# Altium project NH Speaker Sensor 16CH 2.3_C.PrjPcb (part 1 of 2)
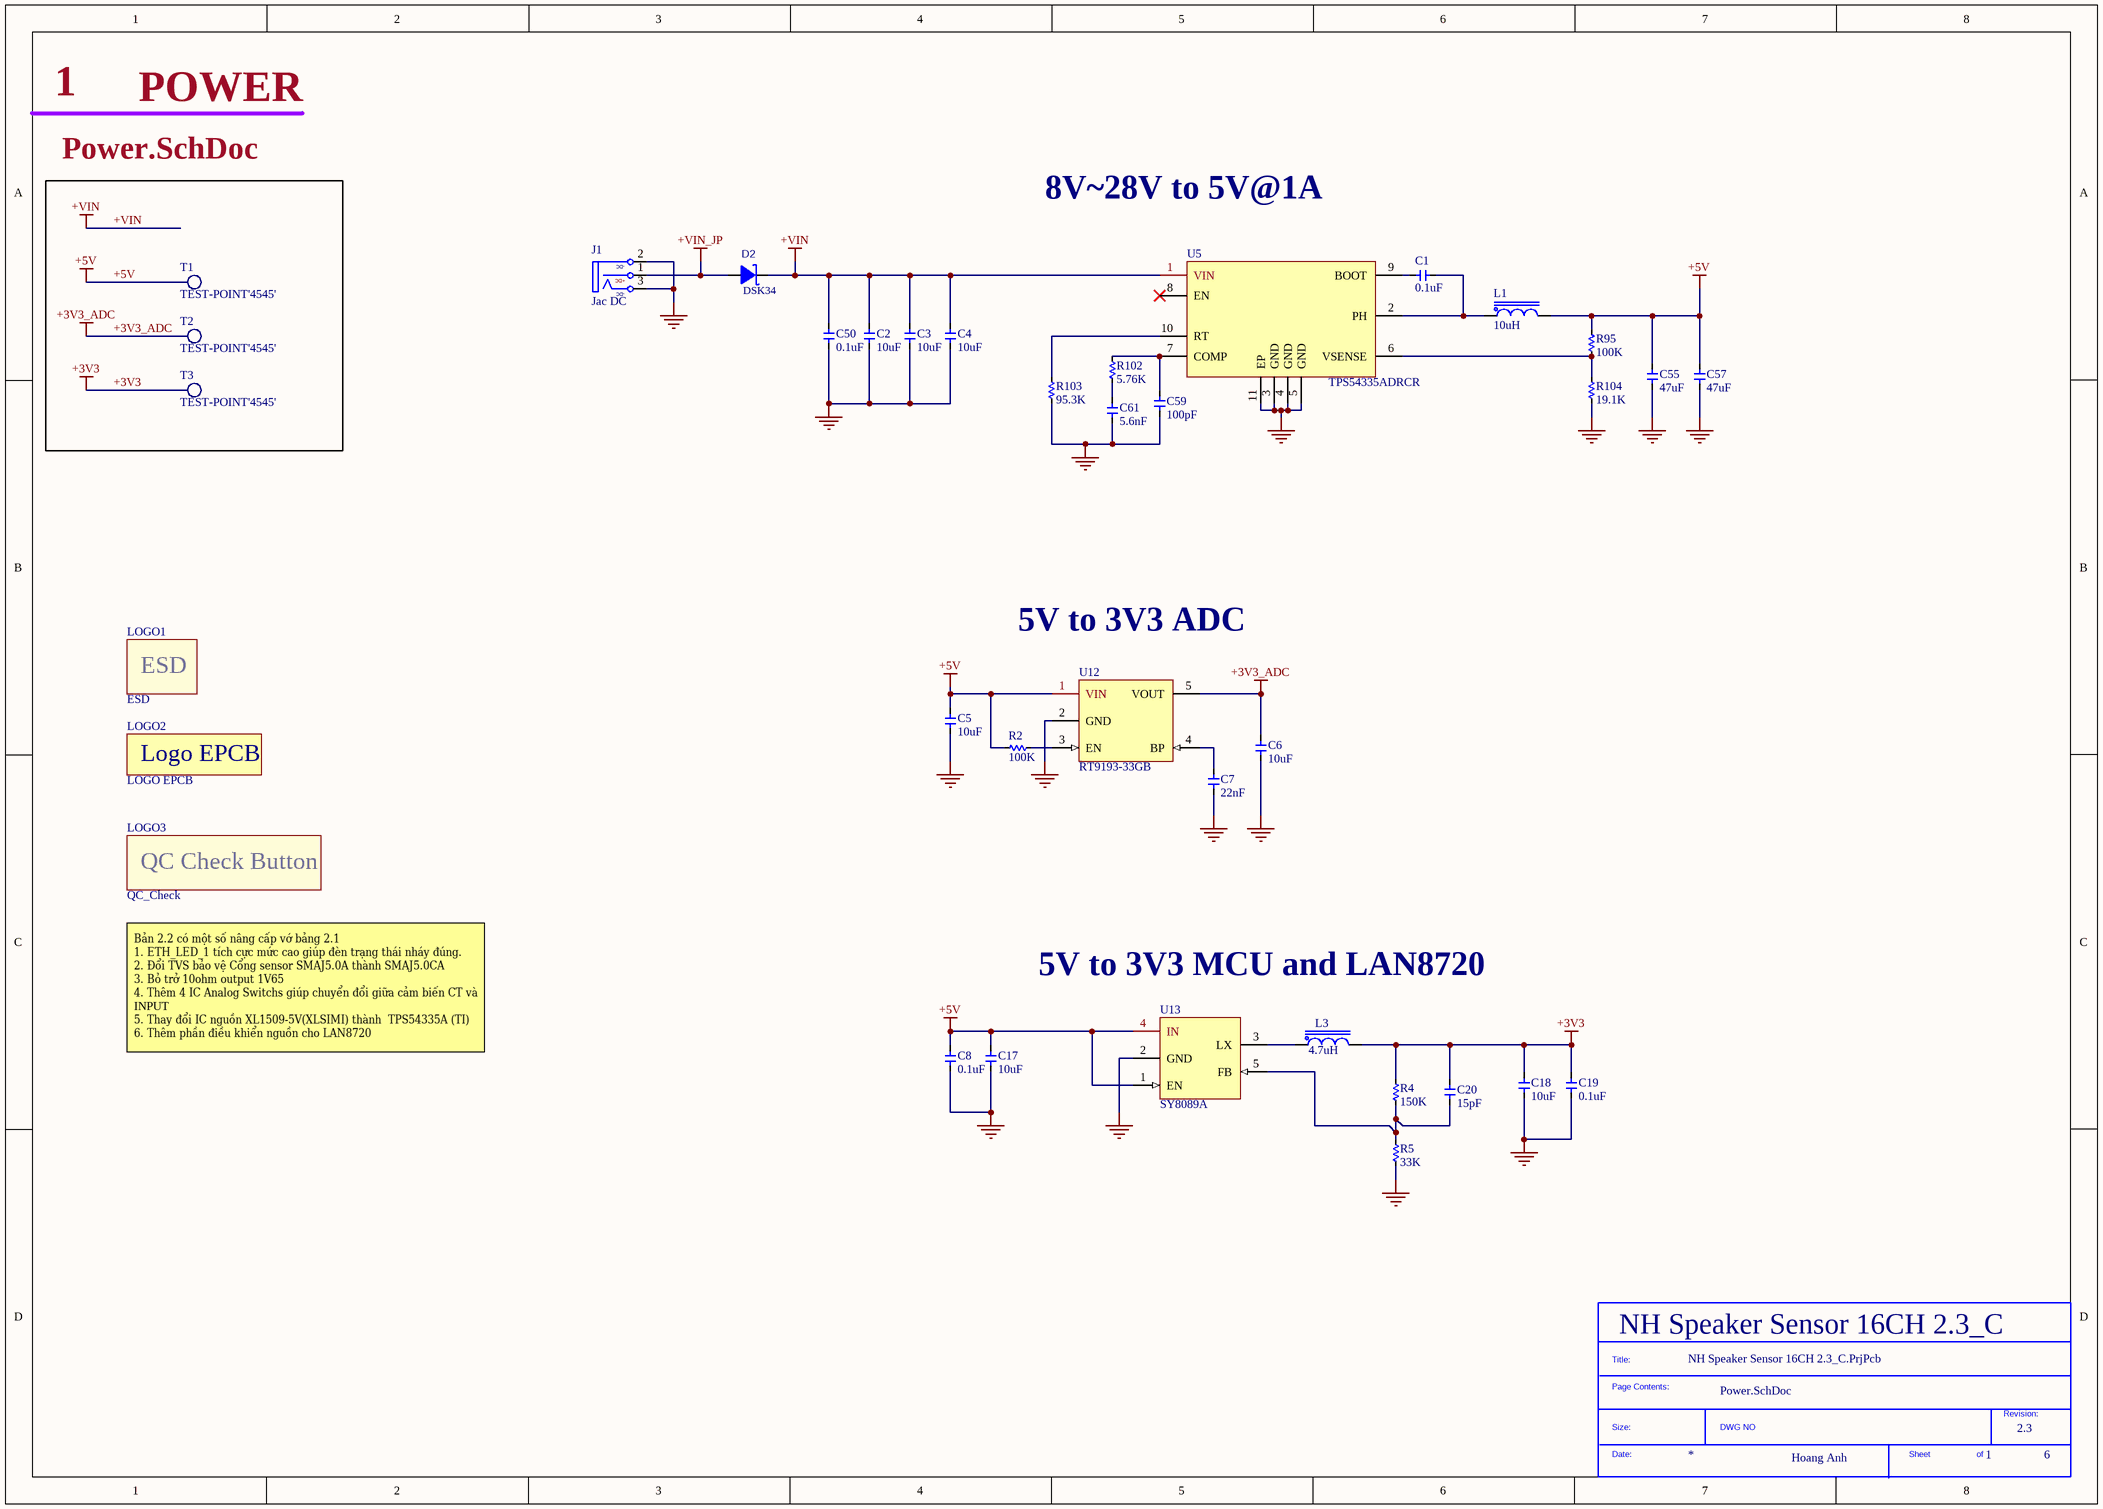
[diagram p0: Power.SchDoc]
DrawnBy_1: Hoang Anh; Revision_1: 1.1; Title_1: NH Speaker Sensor 16CH LAN8720
6 sheets, 309 parts. Net scope: global (net labels, ports and power ports of the same name join across sheets).
Board file: NH Speaker Sensor 16CH 2.3_C.PcbDoc
Sheets:
  Power.SchDoc
  Ethernet.SchDoc
  RS485.SchDoc
  Sensor.SchDoc
  Console.SchDoc
  MCU.SchDoc

## Sheet Power.SchDoc: NH Speaker Sensor 16CH 2.3_C
size A3; Revision: 2.3; SheetNumber: 1; SheetTotal: 6

### Parts
(Parts that share a designator on the sheet are numbered #1, #2 ... from top to bottom, then left to right.)
*?#1  SDTitleBlock  (value not drawn)  (graphical)
C1  0.1uF  [C_0603]
C2  10uF  [C_0805]
C3  10uF  [C_0805]
C4  10uF  [C_0805]
C5  10uF  [C_0603]
C6  10uF  [C_0603]
C7  22nF  [C_0603]
C8  0.1uF  [C_0603]
C17  10uF  [C_0805]
C18  10uF  [C_0805]
C19  0.1uF  [C_0603]
C20  15pF  [C_0603]
C50  0.1uF  [C_0603]
C55  47uF  [C_0805]
C57  47uF  [C_0805]
C59  100pF  [C_0603]
C61  5.6nF  [C_0603]
D2  DSK34  [SOD-123_L2.8-W1.8-LS3.7-RD]
J1  Jac DC  [DC0]
L1  10uH  [IND-SMD_L4.4-W4.2]
L3  4.7uH  [IND-SMD_L4.4-W4.2]
LOGO1  ESD  [LOGO ESD]  (no BOM)
LOGO2  LOGO EPCB  [LOGO EPCB TopLayer]  (no BOM)
LOGO3  QC_Check  [QC_CHECK]  (no BOM)
R2  100K  [R_0603]
R4  150K  [R_0603]
R5  33K  [R_0603]
R95  100K  [R_0603]
R102  5.76K  [R_0603]
R103  95.3K  [R_0603]
R104  19.1K  [R_0603]
T1  TEST-POINT'4545'  [TP-D45MIL]  (no BOM)
T2  TEST-POINT'4545'  [TP-D45MIL]  (no BOM)
T3  TEST-POINT'4545'  [TP-D45MIL]  (no BOM)
U5  TPS54335ADRCR  [VSON-10_L3.0-W3.0-P0.50-TL-EP]
U12  RT9193-33GB  [SOT-23-5_L3.0-W1.7-P0.95-LS2.8-BR]
U13  SY8089A  [SOT-23-5_L3.0-W1.7-P0.95-LS2.8-BR]

### Nets
+3V3: C18.2 C19.2 C20.2 L3.2 R4.1 T3.T
+3V3_ADC: C6.2 T2.T U12.5(VOUT)
+5V: C5.2 C8.2 C17.2 C55.2 C57.2 L1.2 R2.2 R95.1 T1.T U12.1(VIN) U13.1(EN) U13.4(IN)
+VIN: C2.2 C3.2 C4.2 C50.2 D2.1(A) U5.1(VIN)
+VIN_JP: D2.2(K) J1.1(S)
GND: C2.1 C3.1 C4.1 C5.1 C6.1 C7.1 C8.1 C17.1 C18.1 C19.1 C50.1 C55.1 C57.1 C59.1 C61.1 J1.2(T) J1.3(TN) R5.2 R103.2 R104.2 U5.3(GND) U5.4(GND) U5.5(GND) U5.11(EP) U12.2(GND) U13.2(GND)
NetC1_1: C1.1 L1.1 U5.2(PH)
NetC1_2: C1.2 U5.9(BOOT)
NetC7_2: C7.2 U12.4(BP)
NetC20_1: C20.1 R4.2 R5.1 U13.5(FB)
NetC59_2: C59.2 R102.1 U5.7(COMP)
NetC61_2: C61.2 R102.2
NetL3_1: L3.1 U13.3(LX)
NetR2_1: R2.1 U12.3(EN)
NetR95_2: R95.2 R104.1 U5.6(VSENSE)
NetR103_1: R103.1 U5.10(RT)

Not connected (* = marked no-connect by the designer): U5 8(EN)*

### Notes on the sheet
- POWER
- 8V~28V to 5V@1A
- 5V to 3V3 ADC
- 5V to 3V3 MCU and LAN8720
- (near LOGO3) Bản 2.2 có một số nâng cấp vớ bảng 2.1
  1. ETH_LED_1 tích cực mức cao giúp đèn trạng thái nháy đúng.
  2. Đổi TVS bảo vệ Cổng sensor SMAJ5.0A thành SMAJ5.0CA
  3. Bỏ trở 10ohm output 1V65
  4. Thêm 4 IC Analog Switchs giúp chuyển đổi giữa cảm biến CT và INPUT
  5. Thay đổi IC nguồn XL1509-5V(XLSIMI) thành  TPS54335A (TI)
  6. Thêm phần điều khiển nguồn cho LAN8720
- (in symbol DC+02I) -DC; +DC
- (in symbol LOGO EPCB TopLayer) Logo EPCB
- (in symbol QC_Check) QC Check Button
- (in symbol SDTitleBlock) Title:; Page Contents:; Revision:; Size:; DWG NO; Date:; Sheet; of

### Library data of the parts
*?#1 = SDTitleBlock: TitleBlock
C1 C8 C19 C50 = CC0603KRX7R9BB104: 100NF 50V 0603 ROHS; Manufacturer: YAGEO; Manufacturer Part Number: CC0603KRX7R9BB104; Package: 0603; LCSC Part Number: C14663; Assembly type: SMT Assembly; ComponentLink1Description: Digikey Link; ComponentLink1URL: https://www.digikey.com/en/products/detail/yageo/CC0603KRX7R9BB104/2103082?s=N4IgTCBcDaIMwEYEFoFwCzuWZA5AIiALoC%2BQA; ComponentLink2Description: LCSC Link; ComponentLink2URL: https://jlcpcb.com/parts/componentSearch?searchTxt=10k%200603
C2-C4 C17 C18 = GRM21BR61H106KE43L: 10uF ±10% 50V X5R 0805; Manufacturer: Murata Electronics; ComponentLink1URL: https://lcsc.com/product-detail/Multilayer-Ceramic-Capacitors-MLCC-SMD-SMT_SAMSUNG_CL21A106KAYNNNE_10uF-106-10-25V_C15850.html/?href=jlc-SMT; ComponentLink1Description: LCSC Link; Manufacturer Part Number: GRM21BR61H106KE43L; LCSC Part Number: C440198; Package: 0805; Assembly Type: SMT Assembly
C5 C6 = CL10A106KP8NNNC: 10uF 10V 0603 Multilayer Ceramic Capacitors MLCC - SMD/SMT ROHS; Manufacturer: Samsung Electro-Mechanics; Manufacturer Part Number: CL10A106KP8NNNC; Package: 0603; LCSC Part Number: C19702; ComponentLink1Description: Digikey Link; ComponentLink1URL: https://www.digikey.com/en/products/detail/samsung-electro-mechanics/CL10A105KB8NNNC/3887518?s=N4IgTCBcDaIMIBkCMAGAgqgrAaQEIA4A5YuEAXQF8g; ComponentLink2Description: LCSC Link; ComponentLink2URL: https://jlcpcb.com/parts/componentSearch?searchTxt=10k%200603; Assembly Type: SMT Assembly
C7 = CL10B223KB8NNNC: 22nF 50V 0603 Multilayer Ceramic Capacitors MLCC - SMD/SMT ROHS; Manufacturer: Samsung Electro-Mechanics; Manufacturer Part Number: CL10B223KB8NNNC; Package: 0603; LCSC Part Number: C21122; ComponentLink1Description: Digikey Link; ComponentLink2Description: LCSC Link; ComponentLink2URL: https://jlcpcb.com/parts/componentSearch?searchTxt=10k%200603; Assembly Type: SMT Assembly
C20 = CL10C150JB8NNNC: 15pF ±5% 50V C0G 0603 Multilayer Ceramic Capacitors MLCC - SMD/SMT RoHS; Manufacturer: Samsung Electro-Mechanics; Manufacturer Part Number: CL10C150JB8NNNC; Package: 0603; LCSC Part Number: C1644; ComponentLink1Description: Digikey Link; Assembly Type: SMT Assembly
C55 C57 = GRM21BR61A476ME15L: 47uF ±20% 10V X5R 0805 Multilayer Ceramic Capacitors MLCC - SMD/SMT RoHS; Manufacturer: Murata Electronics; ComponentLink1URL: https://lcsc.com/product-detail/Multilayer-Ceramic-Capacitors-MLCC-SMD-SMT_SAMSUNG_CL21A106KAYNNNE_10uF-106-10-25V_C15850.html/?href=jlc-SMT; ComponentLink1Description: LCSC Link; Manufacturer Part Number: GRM21BR61A476ME15L; LCSC Part Number: C124129; Package: 0805; Assembly Type: SMT Assembly
C59 = 0603CG101J500NT: 100pF 50V C0G ±5% 0603 Multilayer Ceramic Capacitors MLCC - SMD/SMT ROHS; Manufacturer: FH(Guangdong Fenghua Advanced Tech); Manufacturer Part Number: 0603CG101J500NT; Package: 0603; LCSC Part Number: C1635; Assembly Type: SMT Assembly; ComponentLink1Description: Digikey Link; ComponentLink2Description: LCSC Link
C61 = 0603B562K500NT: 5.6nF 50V X7R ±10% 0603 Multilayer Ceramic Capacitors MLCC - SMD/SMT ROHS; Manufacturer: FH(Guangdong Fenghua Advanced Tech); Manufacturer Part Number: 0603B562K500NT; Package: 0603; LCSC Part Number: C1628; Assembly Type: SMT Assembly; ComponentLink1Description: Digikey Link
D2 = DSK34: DSK34 40V 550mV@3A 3A SOD-123 Schottky Barrier Diodes (SBD) ROHS Copy; Manufacturer: MDD（Microdiode Electronics); Manufacturer Part Number: DSK34; Package: SOD-123; LCSC Part Number: C41029; Assembly Type: SMT Assembly
J1 = DC+02I: Jac DC input 5.5x2.1MM; Manufacturer: JINJIA; Manufacturer Part Number: DC+02I; LCSC Part Number: C718033; Package: Through Hole; Assembly Type: Hand Soldering
L1 = IND_MWSA0402S-100MT: POWER INDUCTORS SMD,4.2X4.4X2.0MM ROHS; Manufacturer: Sunlord; ComponentLink1URL: http://www.mouser.com/ds/2/390/CDRH5D28RHP-523509.pdf?src-supplier=Mouser; ComponentLink1Description: http://www.mouser.com/ds/2/390/CDRH5D28RHP-523509.pdf?src-supplier=Mouser; ComponentLink2URL: http://products.sumida.com/products/pdf/CDRH5D28RHP.pdf?src-supplier=Digi-Key; ComponentLink2Description: http://products.sumida.com/products/pdf/CDRH5D28RHP.pdf?src-supplier=Digi-Key; ComponentLink3URL: http://www.sumida.com/products/pdf/CDRH5D28,5D28R,5D28RHP.pdf?src-supplier=Avnet; ComponentLink3Description: http://www.sumida.com/products/pdf/CDRH5D28,5D28R,5D28RHP.pdf?src-supplier=Avnet; ComponentLink4URL: http://datasheet.octopart.com/CDRH5D28RHPNP-4R7NC-Sumida-datasheet-8324507.pdf?src-supplier=_legacy+Avnet; ComponentLink4Description: http://datasheet.octopart.com/CDRH5D28RHPNP-4R7NC-Sumida-datasheet-8324507.pdf?src-supplier=_legacy+Avnet; Manufacturer Part Number: MWSA0402S-100MT; LCSC Part Number: C408339; Package: SMD-4.2x4.4x2.0; Assembly Type: SMT Assembly
L3 = IND_MWSA0402S-4R7MT: 4.7uH IND 4.2x4.4x2.0mm 2.8A 4.7uH ±20% 105mΩ SMD Power Inductors ROHS; Manufacturer: Sunlord; Manufacturer Part Number: MWSA0402S-4R7MT; LCSC Part Number: C408337; Package: SMD-4.2x4.4x2.0; Assembly Type: SMT Assembly
LOGO1 = ESD: lOGO ESD
LOGO2 = LOGO EPCB TopLayer
R2 R95 = 0603WAF1003T5E: 100KOHMS ±1% 1/10W 0603 ROHS; Manufacturer: Uniroyal Elec; Manufacturer Part Number: 0603WAF1003T5E; LCSC Part Number: C25803; Package: 0603; Assembly Type: SMT Assembly
R4 = 0603WAF1503T5E: 150kΩ ±1% ±100ppm/℃ 0.1W 0603 Chip Resistor - Surface Mount ROHS; Manufacturer: Uniroyal Elec; Manufacturer Part Number: 0603WAF1503T5E; LCSC Part Number: C22807; Package: 0603; Assembly Type: SMT Assembly
R5 = 0603WAF3302T5E: 33KOHMS ±1% 1/10W 0603 ROHS; Manufacturer: Uniroyal Elec; ComponentLink1URL: https://datasheet.ciiva.com/8883/pyu-rc0603-51-rohs-l-4-8883051.pdf?src-supplier=Avnet; ComponentLink1Description: https://datasheet.ciiva.com/8883/pyu-rc0603-51-rohs-l-4-8883051.pdf?src-supplier=Avnet; ComponentLink2URL: https://datasheet.ciiva.com/7746/443971-7746461.pdf?src-supplier=Element14; ComponentLink2Description: https://datasheet.ciiva.com/7746/443971-7746461.pdf?src-supplier=Element14; ComponentLink3URL: https://datasheet.ciiva.com/22747/443971-22747533.pdf?src-supplier=Element14; ComponentLink3Description: https://datasheet.ciiva.com/22747/443971-22747533.pdf?src-supplier=Element14; ComponentLink4URL: https://datasheet.ciiva.com/7746/443971-7746462.pdf?src-supplier=Element14; ComponentLink4Description: https://datasheet.ciiva.com/7746/443971-7746462.pdf?src-supplier=Element14; Manufacturer Part Number: 0603WAF3302T5E; LCSC Part Number: C4216; Package: 0603; Assembly Type: SMT Assembly
R102 = 0603WAF5761T5E: 5.76kΩ 0603 1/10W Thick Film Resistors 75V ±1% ±100ppm/℃ -55℃~+155℃ Chip Resistor - Surface Mount ROHS; Manufacturer: Uniroyal Elec; Manufacturer Part Number: 0603WAF5761T5E; LCSC Part Number: C23070; Package: 0603; Assembly Type: SMT Assembly
R103 = 0603WAF9532T5E: 95.3kΩ 0603 1/10W Thick Film Resistors 75V ±1% ±100ppm/℃ -55℃~+155℃ Chip Resistor - Surface Mount ROHS; Manufacturer: Uniroyal Elec; Manufacturer Part Number: 0603WAF9532T5E; LCSC Part Number: C23267; Package: 0603; Assembly Type: SMT Assembly
R104 = 0603WAF1912T5E: 19.1kΩ 0603 1/10W Thick Film Resistors 75V ±1% ±100ppm/℃ -55℃~+155℃ Chip Resistor - Surface Mount ROHS; Manufacturer: Uniroyal Elec; Manufacturer Part Number: 0603WAF1912T5E; LCSC Part Number: C22897; Package: 0603; Assembly Type: SMT Assembly
T1-T3 = TEST-POINT'4545': Manufacturer: No; Manufacturer Part Number: No; LCSC Part Number: No; Package: No
U5 = TPS54335ADRCR: TPS54335A 28V 3A SOP-8_EP_150mil DC-DC Converters RoHS; Manufacturer: Texas Instruments; Manufacturer Part Number: TPS54335ADRCR; ComponentLink1URL: http://www.jameco.com/Jameco/Products/ProdDS/1523997.pdf?src-supplier=Jameco; ComponentLink1Description: http://www.jameco.com/Jameco/Products/ProdDS/1523997.pdf?src-supplier=Jameco; ComponentLink2URL: http://www.ti.com/general/docs/lit/getliterature.tsp?genericPartNumber=TPS5431&&fileType=pdf&src-supplier=Avnet; ComponentLink2Description: http://www.ti.com/general/docs/lit/getliterature.tsp?genericPartNumber=TPS5431&&fileType=pdf&src-supplier=Avnet; ComponentLink3URL: http://focus.ti.com/lit/ds/symlink/tps5430.pdf?src-supplier=Avnet+Europe; ComponentLink3Description: http://focus.ti.com/lit/ds/symlink/tps5430.pdf?src-supplier=Avnet+Europe; ComponentLink4URL: http://www.ti.com/lit/ds/symlink/tps5431.pdf?src-supplier=Digi-Key; ComponentLink4Description: http://www.ti.com/lit/ds/symlink/tps5431.pdf?src-supplier=Digi-Key; ComponentLink5URL: https://www.verical.com/server-webapp/html/getDatasheet?partID=214658&src-supplier=Verical; ComponentLink5Description: https://www.verical.com/server-webapp/html/getDatasheet?partID=214658&src-supplier=Verical; ComponentLink6URL: http://www.produktinfo.conrad.com/datenblaetter/1000000-1099999/001014839-da-01-en-IC_REG_BUCK_ADJ_3_TPS5430DDAR_SOIC_8_TID.pdf?src-supplier=Conrad; ComponentLink6Description: http://www.produktinfo.conrad.com/datenblaetter/1000000-1099999/001014839-da-01-en-IC_REG_BUCK_ADJ_3_TPS5430DDAR_SOIC_8_TID.pdf?src-supplier=Conrad; Package: VSON-10; LCSC Part Number: C473400; Assembly Type: SMT Assembly
U12 = RT9193-33GB: 5.5V 300mV @ 300mA - - Fixed 3.3V SOT-23-5 Linear Voltage Regulators (LDO) ROHS; Manufacturer: Richtek Tech; Manufacturer Part Number: RT9193-33GB; Package: SOT-23-5; LCSC Part Number: C15651; Assembly Type: SMT Assembly
U13 = SY8089A1AAC: High Efficiency 5.5V, 2A continuous, 3A peak, 1MHz  Synchronous Step Down Regulator; Manufacturer: Silergy Corp; Manufacturer Part Number: SY8089A1AAC; LCSC Part Number: C479074; Package: SOT-23-5; Assembly Type: SMT Assembly

## Sheet Ethernet.SchDoc: NH Speaker Sensor 16CH 2.3_C
size A3; Revision: 2.3; SheetNumber: 2; SheetTotal: 6
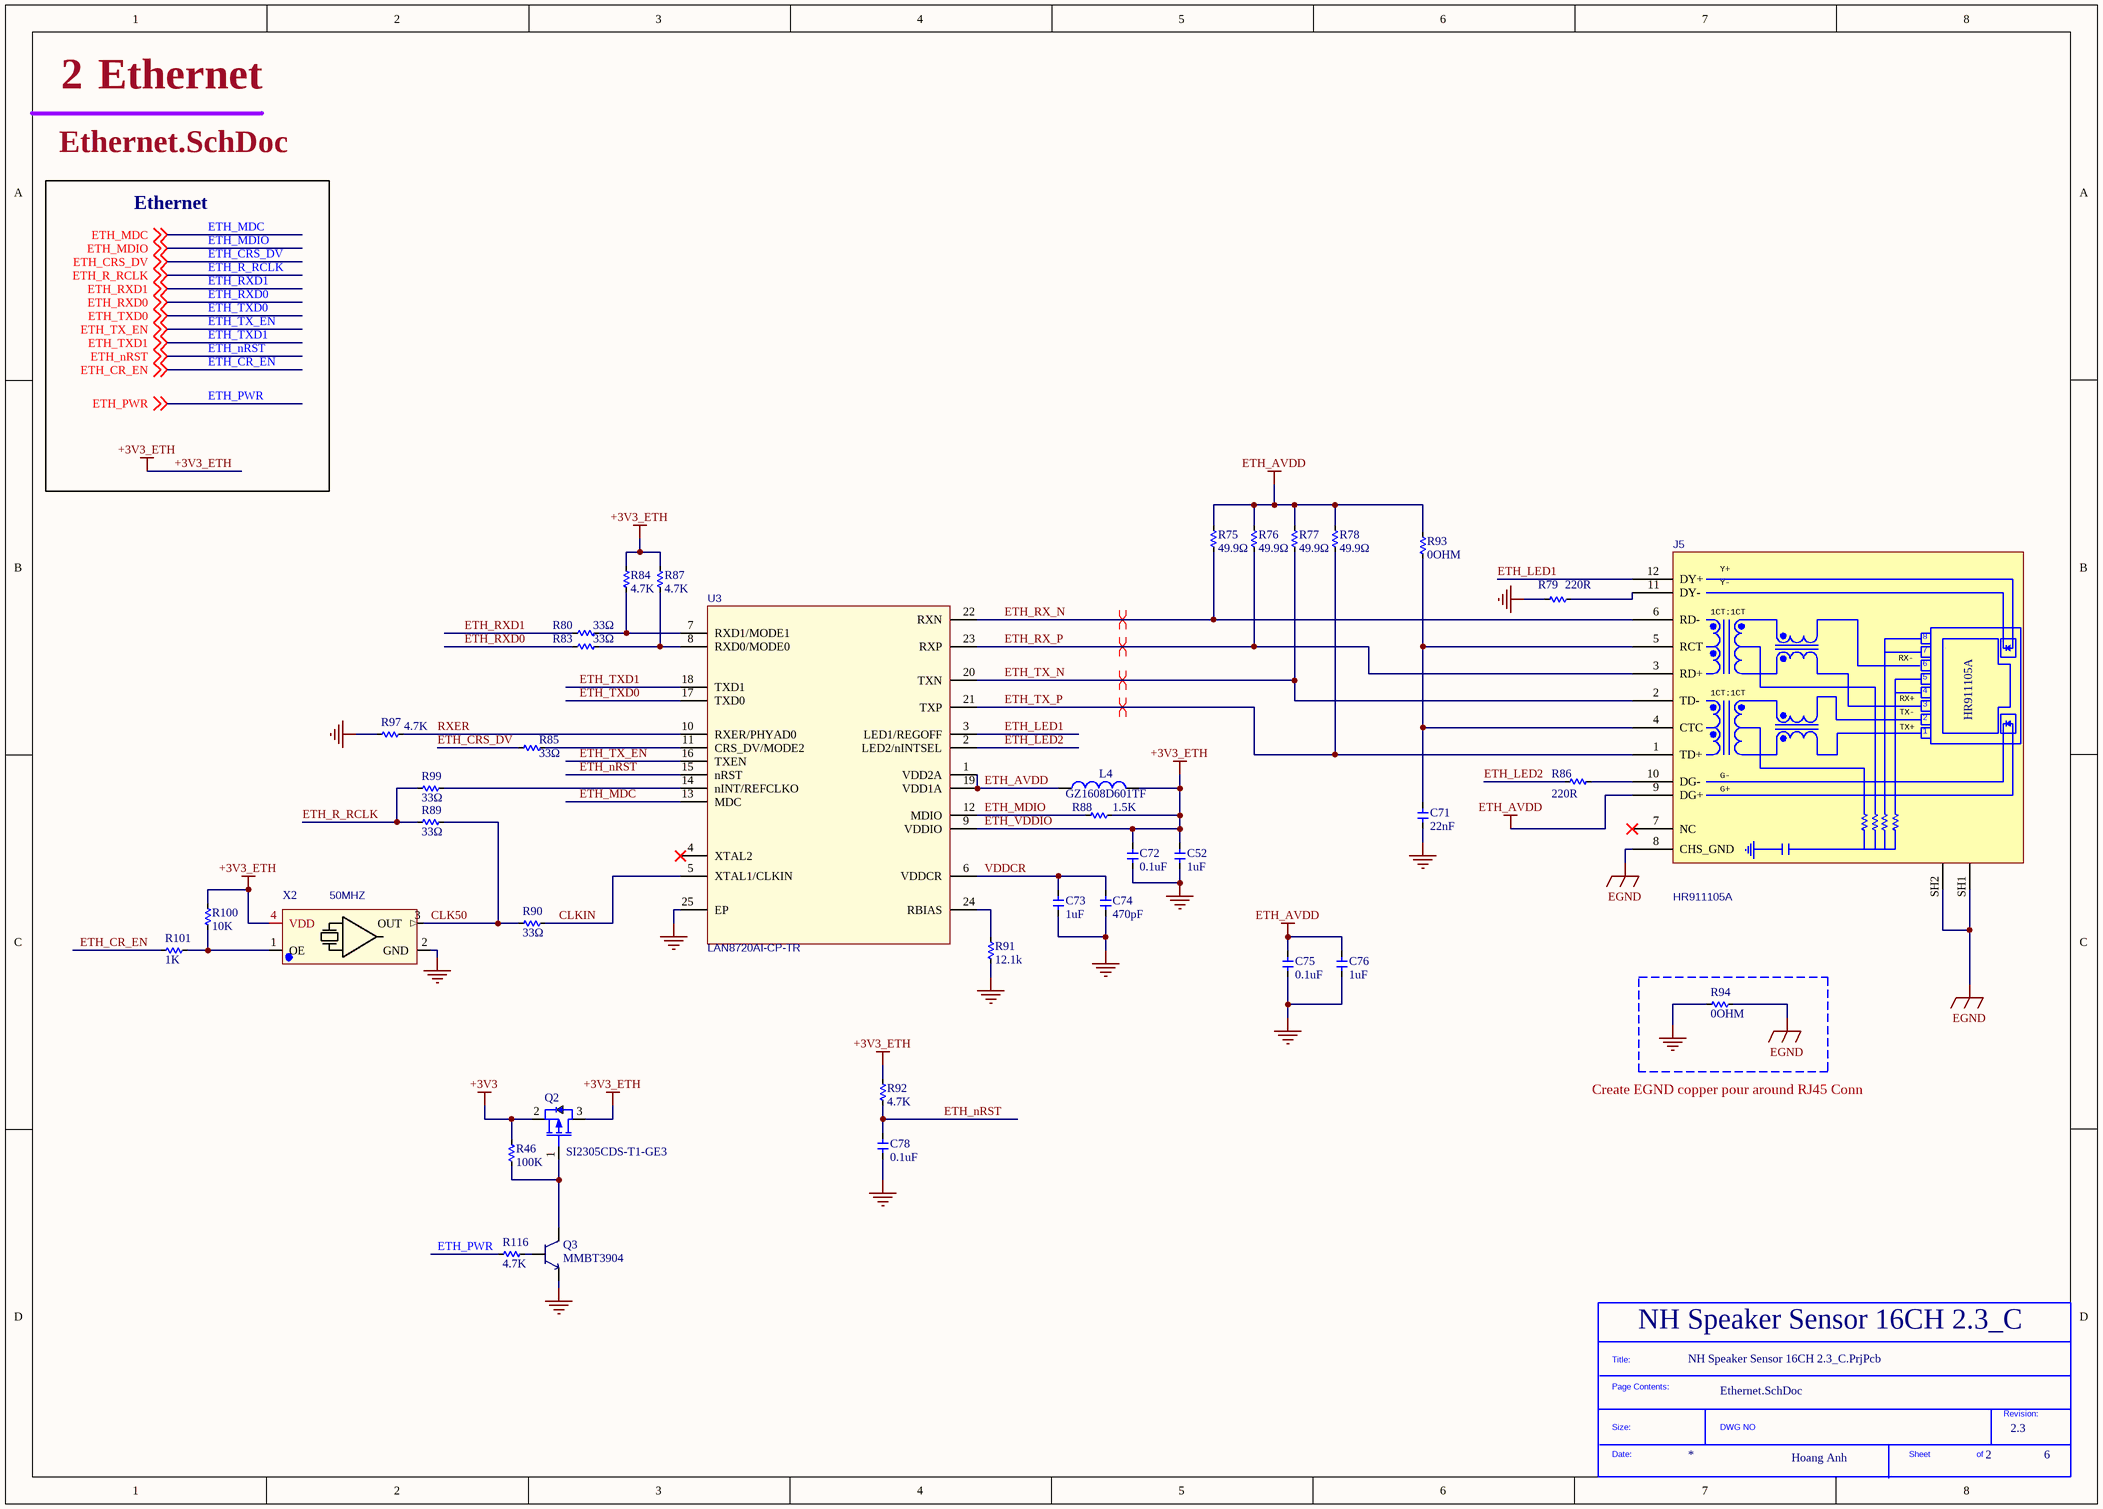
[diagram p1: Ethernet.SchDoc]

### Parts
(Parts that share a designator on the sheet are numbered #1, #2 ... from top to bottom, then left to right.)
*?#2  SDTitleBlock  (value not drawn)  (graphical)
C52  1uF  [C_0603]
C71  22nF  [C_0603]
C72  0.1uF  [C_0603]
C73  1uF  [C_0603]
C74  470pF  [C_0603]
C75  0.1uF  [C_0603]
C76  1uF  [C_0603]
C78  0.1uF  [C_0603]
J5  HR911105A  [RJ45-TH_HR911105A]
L4  GZ1608D601TF  [L_0603]
Q2  SI2305CDS-T1-GE3  [SOT-23-3_L2.9-W1.6-P1.90-LS2.8-BR]
Q3  MMBT3904  [SOT-23-3_L2.9-W1.3-P1.90-LS2.4-BR]
R46  100K  [R_0603]
R75  49.9Ω  [R_0603]
R76  49.9Ω  [R_0603]
R77  49.9Ω  [R_0603]
R78  49.9Ω  [R_0603]
R79  220R  [R_0603]
R80  33Ω  [R_0603]
R83  33Ω  [R_0603]
R84  4.7K  [R_0603]
R85  33Ω  [R_0603]
R86  220R  [R_0603]
R87  4.7K  [R_0603]
R88  1.5K  [R_0603]
R89  33Ω  [R_0603]
R90  33Ω  [R_0603]
R91  12.1k  [R_0603]
R92  4.7K  [R_0603]
R93  0OHM  [R_0603]
R94  0OHM  [R_0603]
R97  4.7K  [R_0603]
R99  33Ω  [R_0603]
R100  10K  [R_0603]
R101  1K  [R_0603]
R116  4.7K  [R_0603]
U3  LAN8720AI-CP-TR  [QFN-24_L4.0-W4.0-P0.50-BL-EP2.6]
X2  50MHZ  [SMD-3225_4P]

### Nets
+3V3: Q2.2(S) R46.1
+3V3_ETH: C52.2 C72.2 L4.2 Q2.3(D) R84.1 R87.1 R88.1 R92.1 R100.1 U3.9(VDDIO) X2.4(VDD)  [also labelled ETH_VDDIO]
EGND: J5.8(CHS_GND) J5.SH1 J5.SH2 R94.1
ETH_AVDD: C75.2 C76.2 J5.9(DG+) L4.1 R75.1 R76.1 R77.1 R78.1 R93.1 U3.1(VDD2A) U3.19(VDD1A)
GND: C52.1 C71.1 C72.1 C73.1 C74.1 C75.1 C76.1 C78.1 Q3.2 R79.2 R91.2 R94.2 R97.2 U3.25(EP) X2.2(GND)
CLK50: R89.1 R90.2 X2.3(OUT)
CLKIN: R90.1 U3.5(XTAL1/CLKIN)
ETH_CR_EN: R101.2 ; off-sheet ETH_CR_EN
ETH_CRS_DV: R85.2 ; off-sheet ETH_CRS_DV
ETH_LED1: J5.12(DY+) U3.3(LED1/REGOFF)
ETH_LED2: R86.2 U3.2(LED2/nINTSEL)
ETH_MDC: U3.13(MDC) ; off-sheet ETH_MDC
ETH_MDIO: R88.2 U3.12(MDIO) ; off-sheet ETH_MDIO
ETH_nRST: C78.2 R92.2 U3.15(nRST) ; off-sheet ETH_nRST
ETH_PWR: R116.2 ; off-sheet ETH_PWR
ETH_R_RCLK: R89.2 R99.2 ; off-sheet ETH_R_RCLK
ETH_RX_N: J5.6(RD-) R75.2 U3.22(RXN)
ETH_RX_P: J5.3(RD+) R76.2 U3.23(RXP)
ETH_RXD0: R83.2 ; off-sheet ETH_RXD0
ETH_RXD1: R80.2 ; off-sheet ETH_RXD1
ETH_TX_EN: U3.16(TXEN) ; off-sheet ETH_TX_EN
ETH_TX_N: J5.2(TD-) R77.2 U3.20(TXN)
ETH_TX_P: J5.1(TD+) R78.2 U3.21(TXP)
ETH_TXD0: U3.17(TXD0) ; off-sheet ETH_TXD0
ETH_TXD1: U3.18(TXD1) ; off-sheet ETH_TXD1
RXER: R97.1 U3.10(RXER/PHYAD0)
VDDCR: C73.2 C74.2 U3.6(VDDCR)
NetC71_2: C71.2 J5.4(CTC) J5.5(RCT) R93.2
NetJ5_10: J5.10(DG-) R86.1
NetJ5_11: J5.11(DY-) R79.1
NetQ2_1: Q2.1(G) Q3.3 R46.2
NetQ3_1: Q3.1 R116.1
NetR80_1: R80.1 R84.2 U3.7(RXD1/MODE1)
NetR83_1: R83.1 R87.2 U3.8(RXD0/MODE0)
NetR85_1: R85.1 U3.11(CRS_DV/MODE2)
NetR91_1: R91.1 U3.24(RBIAS)
NetR99_1: R99.1 U3.14(nINT/REFCLKO)
NetR100_2: R100.2 R101.1 X2.1(OE)

Not connected (* = marked no-connect by the designer): J5 7(NC)*; U3 4(XTAL2)*

### Layout directives
differential pair: ETH_RX_N, ETH_RX_P, ETH_TX_N, ETH_TX_P

### Notes on the sheet
- Ethernet
- Create EGND copper pour around RJ45 Conn
- (in symbol RJ45_HR911105A) Y+; Y-; 1CT:1CT; RX-; RX+; TX-; TX+; G-; G+
- (in symbol SDTitleBlock) Title:; Page Contents:; Revision:; Size:; DWG NO; Date:; Sheet; of

### Library data of the parts
*?#2 = SDTitleBlock: TitleBlock
C52 C73 C76 = CL10A105KB8NNNC: 1UF 50V 0603 ROHS; Manufacturer: Samsung Electro-Mechanics; Manufacturer Part Number: CL10A105KB8NNNC; Package: 0603; LCSC Part Number: C15849; ComponentLink1Description: Digikey Link; ComponentLink1URL: https://www.digikey.com/en/products/detail/samsung-electro-mechanics/CL10A105KB8NNNC/3887518?s=N4IgTCBcDaIMIBkCMAGAgqgrAaQEIA4A5YuEAXQF8g; ComponentLink2Description: LCSC Link; ComponentLink2URL: https://jlcpcb.com/parts/componentSearch?searchTxt=10k%200603; Assembly Type: SMT Assembly
C71 = CL10B223KB8NNNC: as C7 on sheet Power; Manufacturer Part Number: CL10B223KB8NNNC; Package: 0603; LCSC Part Number: C21122; ComponentLink1Description: Digikey Link; ComponentLink2Description: LCSC Link; ComponentLink2URL: https://jlcpcb.com/parts/componentSearch?searchTxt=10k%200603; Assembly Type: SMT Assembly
C72 C75 C78 = CC0603KRX7R9BB104: 100NF 50V 0603 ROHS; Manufacturer: YAGEO; Manufacturer Part Number: CC0603KRX7R9BB104; Package: 0603; LCSC Part Number: C14663; ComponentLink1Description: Digikey Link; ComponentLink1URL: https://www.digikey.com/en/products/detail/yageo/CC0603KRX7R9BB104/2103082?s=N4IgTCBcDaIMwEYEFoFwCzuWZA5AIiALoC%2BQA; ComponentLink2Description: LCSC Link; ComponentLink2URL: https://jlcpcb.com/parts/componentSearch?searchTxt=10k%200603; Assembly type: SMT Assembly
C74 = 0603B471K500NT: 470pF 50V 0603 Multilayer Ceramic Capacitors MLCC - SMD/SMT ROHS; Manufacturer: FH(Guangdong Fenghua Advanced Tech); Manufacturer Part Number: 0603B471K500NT; Package: 0603; LCSC Part Number: C1620; ComponentLink1Description: Digikey Link; ComponentLink2Description: LCSC Link; ComponentLink2URL: https://jlcpcb.com/parts/componentSearch?searchTxt=10k%200603; Assembly Type: SMT Assembly
J5 = RJ45_HR911105A: RJ45 12 1 Green - Yellow Through Hole Ethernet Connectors/Modular Connectors (RJ45 RJ11) RoHS; Manufacturer: HANRUN; Manufacturer Part Number: HR911105A; LCSC Part Number: C12074; Package: Through Hole; Assembly Type: Hand Soldering
L4 = FB_GZ1608D601TF: 600Ω @ 100MHz 1 200mA 450mΩ 0603 Ferrite Beads ROHS; Manufacturer: Sunlord; Manufacturer Part Number: GZ1608D601TF; LCSC Part Number: C1002; Package: 0603; Assembly Type: SMT Assembly
Q2 = SI2305CDS-T1-GE3: SI2305CDS-T1-GE3 8V 5.8A 35mΩ@4.5V,4.4A P Channel SOT-23  MOSFETs ROHS; Manufacturer: Vishay Intertech; Manufacturer Part Number: SI2305CDS-T1-GE3; LCSC Part Number: C37577; Package: SOT-23-3; Assembly Type: SMT Assembly
Q3 = MMBT3904: MMBT3904 TRANSISTORS (NPN/PNP) NPN 200MA 40V SOT-23(SOT-23-3) ROHS; Manufacturer: Changjiang Electronics Tech (CJ); Manufacturer Part Number: MMBT3904; LCSC Part Number: C20526; Package: SOT-23-3; Assembly Type: SMT Assembly
R46 = 0603WAF1003T5E: as R2 on sheet Power; Manufacturer Part Number: 0603WAF1003T5E; LCSC Part Number: C25803; Package: 0603; Assembly Type: SMT Assembly
R75-R78 = 0603WAF499JT5E: 49.9OHM ±1% ±1% 0.1W ±200ppm/℃ 0603 Chip Resistor - Surface Mount RoHS; Manufacturer: Uniroyal Elec; Manufacturer Part Number: 0603WAF499JT5E; LCSC Part Number: C23185; Package: 0603; Assembly Type: SMT Assembly
R79 R86 = 0603WAF2200T5E: 220R 22OHMS ±1% 1/10W 0603 ROHS; Manufacturer: Uniroyal Elec; Manufacturer Part Number: 0603WAF2200T5E; LCSC Part Number: C22962; Package: 0603; Assembly Type: SMT Assembly
R80 R83 R85 R89 R90 R99 = 0603WAF330JT5E: 33OHM ±1% 0.1W ±100ppm/℃ 0603 Chip Resistor - Surface Mount RoHS; Manufacturer: Uniroyal Elec; Manufacturer Part Number: 0603WAF330JT5E; LCSC Part Number: C23140; Package: 0603; Assembly Type: SMT Assembly
R84 R87 R92 R97 R116 = 0603WAF4701T5E: 4.7KOHMS ±1% 1/10W 0603 ROHS; Manufacturer: Uniroyal Elec; Manufacturer Part Number: 0603WAF4701T5E; LCSC Part Number: C23162; Package: 0603; Assembly Type: SMT Assembly
R88 = 0603WAF1501T5E: 1.5KOHMS ±1% 1/10W 0603 ROHS; Manufacturer: Uniroyal Elec; ComponentLink1URL: https://datasheet.ciiva.com/8883/pyu-rc0603-51-rohs-l-4-8883051.pdf?src-supplier=Avnet; ComponentLink1Description: https://datasheet.ciiva.com/8883/pyu-rc0603-51-rohs-l-4-8883051.pdf?src-supplier=Avnet; ComponentLink2URL: https://datasheet.ciiva.com/7746/443971-7746461.pdf?src-supplier=Element14; ComponentLink2Description: https://datasheet.ciiva.com/7746/443971-7746461.pdf?src-supplier=Element14; ComponentLink3URL: https://datasheet.ciiva.com/22747/443971-22747533.pdf?src-supplier=Element14; ComponentLink3Description: https://datasheet.ciiva.com/22747/443971-22747533.pdf?src-supplier=Element14; ComponentLink4URL: https://datasheet.ciiva.com/7746/443971-7746462.pdf?src-supplier=Element14; ComponentLink4Description: https://datasheet.ciiva.com/7746/443971-7746462.pdf?src-supplier=Element14; Manufacturer Part Number: 0603WAF1501T5E; LCSC Part Number: C22843; Package: 0603; Assembly Type: SMT Assembly
R91 = 0603WAF1212T5E: 12.1kΩ ±1% 0.1W ±100ppm/℃ 0603 Chip Resistor - Surface Mount RoHS; Manufacturer: Uniroyal Elec; Manufacturer Part Number: 0603WAF1212T5E; LCSC Part Number: C22864; Package: 0603; Assembly Type: SMT Assembly
R93 R94 = 0603WAF0000T5E: 0OHMS ±1% 1/10W 0603 ROHS; Manufacturer: Uniroyal Elec; Manufacturer Part Number: 0603WAF0000T5E; LCSC Part Number: C21189; Package: 0603; Assembly Type: SMT Assembly
R100 = 0603WAF1002T5E: 10KOHMS ±1% 1/10W 0603 ROHS; Manufacturer: Uniroyal Elec; Manufacturer Part Number: 0603WAF1002T5E; LCSC Part Number: C25804; Package: 0603; Assembly Type: SMT Assembly
R101 = 0603WAF1001T5E: 1KOHMS ±1% 1/10W 0603 ROHS; Manufacturer: Uniroyal Elec; Manufacturer Part Number: 0603WAF1001T5E; LCSC Part Number: C21190; Package: 0603; Assembly Type: SMT Assembly
U3 = LAN8720AI-CP-TR: Ethernet Transceivers 10/100 Base-T/TX PHY RMII 1.6V ~ 3.6V QFN-24_4x4x05P Ethernet ICs RoHS; Manufacturer: SMSC; Manufacturer Part Number: LAN8720AI-CP-TR; LCSC Part Number: C17146; Package: QFN-24_4x4x05P; Assembly Type: SMT Assembly
X2 = HSO321S: HSO321S 50MHZ 3.3V 50PPM -40~+85℃; Manufacturer: HELE(Harmony Elec); Package: SMD-3225_4P; Manufacturer Part Number: HSO321S 50MHZ 3.3V 50PPM -40~+85℃; LCSC Part Number: C160451; Assembly Type: SMT Assembly

## Sheet RS485.SchDoc: NH Speaker Sensor 16CH 2.3_C
size A3; Revision: 2.3; SheetNumber: 3; SheetTotal: 6
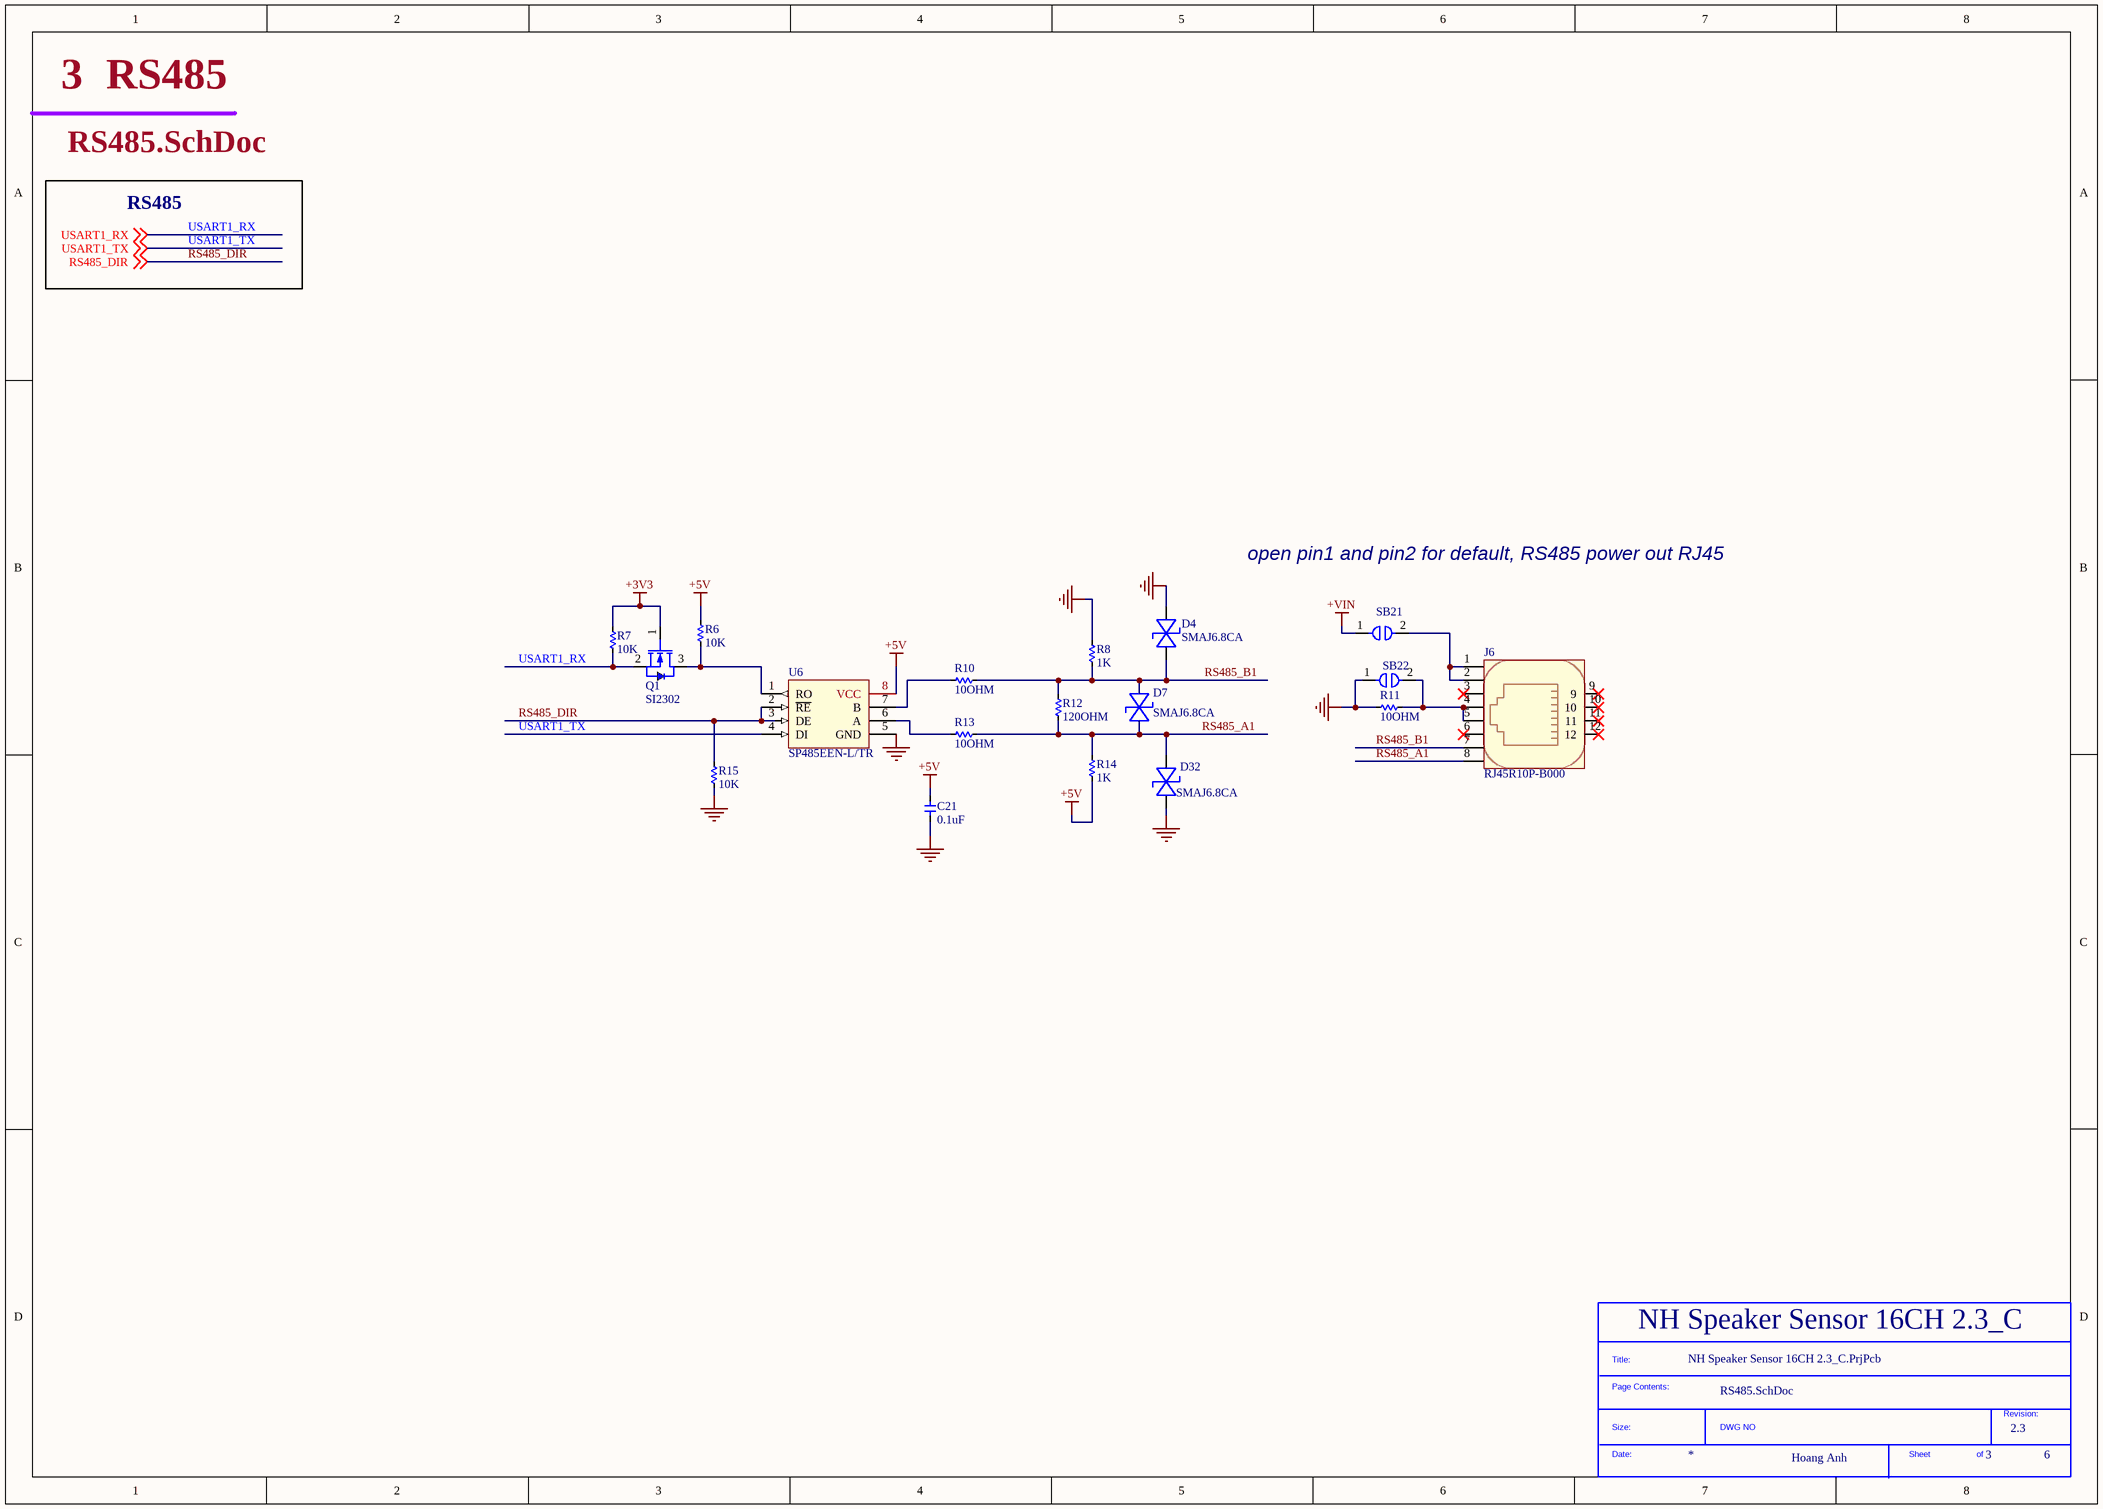
[diagram p2: RS485.SchDoc]

### Parts
(Parts that share a designator on the sheet are numbered #1, #2 ... from top to bottom, then left to right.)
*?#3  SDTitleBlock  (value not drawn)  (graphical)
C21  0.1uF  [C_0603]
D4  SMAJ6.8CA  [SMA,DO-214AC - CA]
D7  SMAJ6.8CA  [SMA,DO-214AC - CA]
D32  SMAJ6.8CA  [SMA,DO-214AC - CA]
J6  RJ45R10P-B000  [RJ45-TH_R-RJ45R10P-B000]
Q1  SI2302  [SOT-23-3_L2.9-W1.6-P1.90-LS2.8-BR]
R6  10K  [R_0603]
R7  10K  [R_0603]
R8  1K  [R_0603]
R10  10OHM  [R_0805]
R11  10OHM  [R_0603]
R12  120OHM  [R_0603]
R13  10OHM  [R_0805]
R14  1K  [R_0603]
R15  10K  [R_0603]
SB21  SOLDERJUMPER_1WAY  [SOLDERJUMPER_1WAY]  (value not drawn)  (no BOM)
SB22  SOLDERJUMPER_1WAY  [SOLDERJUMPER_1WAY]  (value not drawn)  (no BOM)
U6  SP485EEN-L/TR  [SOIC-8_3.9x4.9x1.27P]

### Nets
+3V3: Q1.1(G) R7.1
+5V: C21.2 R6.1 R14.2 U6.8(VCC)
+VIN: SB21.1
GND: C21.1 D4.1(A) D32.2(K) R8.1 R11.2 R15.2 SB22.1 U6.5(GND)
RS485_A1: D7.2(K) D32.1(A) J6.8 R12.2 R13.1 R14.1
RS485_B1: D4.2(K) D7.1(A) J6.7 R8.2 R10.1 R12.1
RS485_DIR: R15.1 U6.2(~{RE}) U6.3(DE) ; off-sheet RS485_DIR
USART1_RX: Q1.2(S) R7.2 ; off-sheet USART1_RX
USART1_TX: U6.4(DI) ; off-sheet USART1_TX
NetJ6_1: J6.1 J6.2 SB21.2
NetJ6_4: J6.4 J6.5 R11.1 SB22.2
NetQ1_3: Q1.3(D) R6.2 U6.1(RO)
NetR10_2: R10.2 U6.7(B)
NetR13_2: R13.2 U6.6(A)

Not connected (* = marked no-connect by the designer): J6 3* 6* 9* 10* 11* 12*

### Notes on the sheet
- RS485
- open pin1 and pin2 for default, RS485 power out RJ45
- (in symbol SDTitleBlock) Title:; Page Contents:; Revision:; Size:; DWG NO; Date:; Sheet; of

### Library data of the parts
*?#3 = SDTitleBlock: TitleBlock
C21 = CC0603KRX7R9BB104: 100NF 50V 0603 ROHS; Manufacturer: YAGEO; Manufacturer Part Number: CC0603KRX7R9BB104; Package: 0603; LCSC Part Number: C14663; ComponentLink1Description: Digikey Link; ComponentLink1URL: https://www.digikey.com/en/products/detail/yageo/CC0603KRX7R9BB104/2103082?s=N4IgTCBcDaIMwEYEFoFwCzuWZA5AIiALoC%2BQA; ComponentLink2Description: LCSC Link; ComponentLink2URL: https://jlcpcb.com/parts/componentSearch?searchTxt=10k%200603; Assembly type: SMT Assembly
D4 D7 D32 = SMAJ6.8CA: Bidirectional 6.8V SMA(DO-214AC) TVS RoHS; Manufacturer: Bourne Semicon (Shenzhen); Manufacturer Part Number: SMAJ6.8CA; LCSC Part Number: C406209; Package: SMA,DO-214AC; Assembly Type: SMT Assembly
J6 = RJ45R10P-B000: RJ45 18MM, No Transformer; Manufacturer: Ckmtw(Shenzhen Cankemeng); Manufacturer Part Number: R-RJ45R10P-B000; LCSC Part Number: C386758; Package: Through hole; Assembly Type: Hand Soldering
Q1 = Si2302CDS-T1-GE3: MOSFET N TRENCH 20V 2.9A 850MV @ 250UA 57 M? @ 3.6A,4.5V SOT-23(SOT-23-3) ROHS; Manufacturer: Vishay Intertech; Manufacturer Part Number: Si2302CDS-T1-GE3; LCSC Part Number: C10488; Package: SOT-23-3; Assembly Type: SMT Assembly
R6 R7 R15 = 0603WAF1002T5E: as R100 on sheet Ethernet; Manufacturer Part Number: 0603WAF1002T5E; LCSC Part Number: C25804; Package: 0603; Assembly Type: SMT Assembly
R8 R14 = 0603WAF1001T5E: as R101 on sheet Ethernet; Manufacturer Part Number: 0603WAF1001T5E; LCSC Part Number: C21190; Package: 0603; Assembly Type: SMT Assembly
R10 R13 = 0805W8F100JT5E: 10OHMS ±1% 1/8W 0805 ROHS; Manufacturer: Uniroyal Elec; Manufacturer Part Number: 0805W8F100JT5E; LCSC Part Number: C17415; Package: 0805; Assembly Type: SMT Assembly
R11 = 0603WAF100JT5E: 10OHMS ±1% 1/10W 0603 ROHS; Manufacturer: Uniroyal Elec; Manufacturer Part Number: 0603WAF100JT5E; LCSC Part Number: C22859; Package: 0603; Assembly Type: SMT Assembly
R12 = 0603WAF1200T5E: 120OHMS ±1% 1/10W 0603 ROHS; Manufacturer: Uniroyal Elec; Manufacturer Part Number: 0603WAF1200T5E; Package: 0603; LCSC Part Number: C22787; Assembly Type: SMT Assembly
SB21 SB22 = SOLDERJUMPER_1WAY: GateName_1: G$1; SymbolName_1: SOLDERJUMPER_1WAY; LibraryName: microbuilder; DeviceSetName: SOLDERJUMPER_1WAY
U6 = SP485EEN-L/TR: RS-485 & RS-422 1/1 1MBPS 3.15V ~ 5.5V SOIC-8_150MIL ROHS; Manufacturer: MaxLinear; ComponentLink1URL: http://www.ti.com/lit/ds/symlink/sn65hvd1785.pdf?src-supplier=Digi-Key; ComponentLink1Description: http://www.ti.com/lit/ds/symlink/sn65hvd1785.pdf?src-supplier=Digi-Key; ComponentLink2URL: http://datasheet.iiic.cc/texas_instruments/SN65HVD1785DR.pdf?src-supplier=IIIC; ComponentLink2Description: http://datasheet.iiic.cc/texas_instruments/SN65HVD1785DR.pdf?src-supplier=IIIC; Manufacturer Part Number: SP485EEN-L/TR; LCSC Part Number: C6855; Package: SOIC-8_3.9x4.9x1.27P; Assembly Type: SMT Assembly

## Sheet Sensor.SchDoc: NH Speaker Sensor 16CH 2.3_C
size A2; Revision: 2.3; SheetNumber: 4; SheetTotal: 6
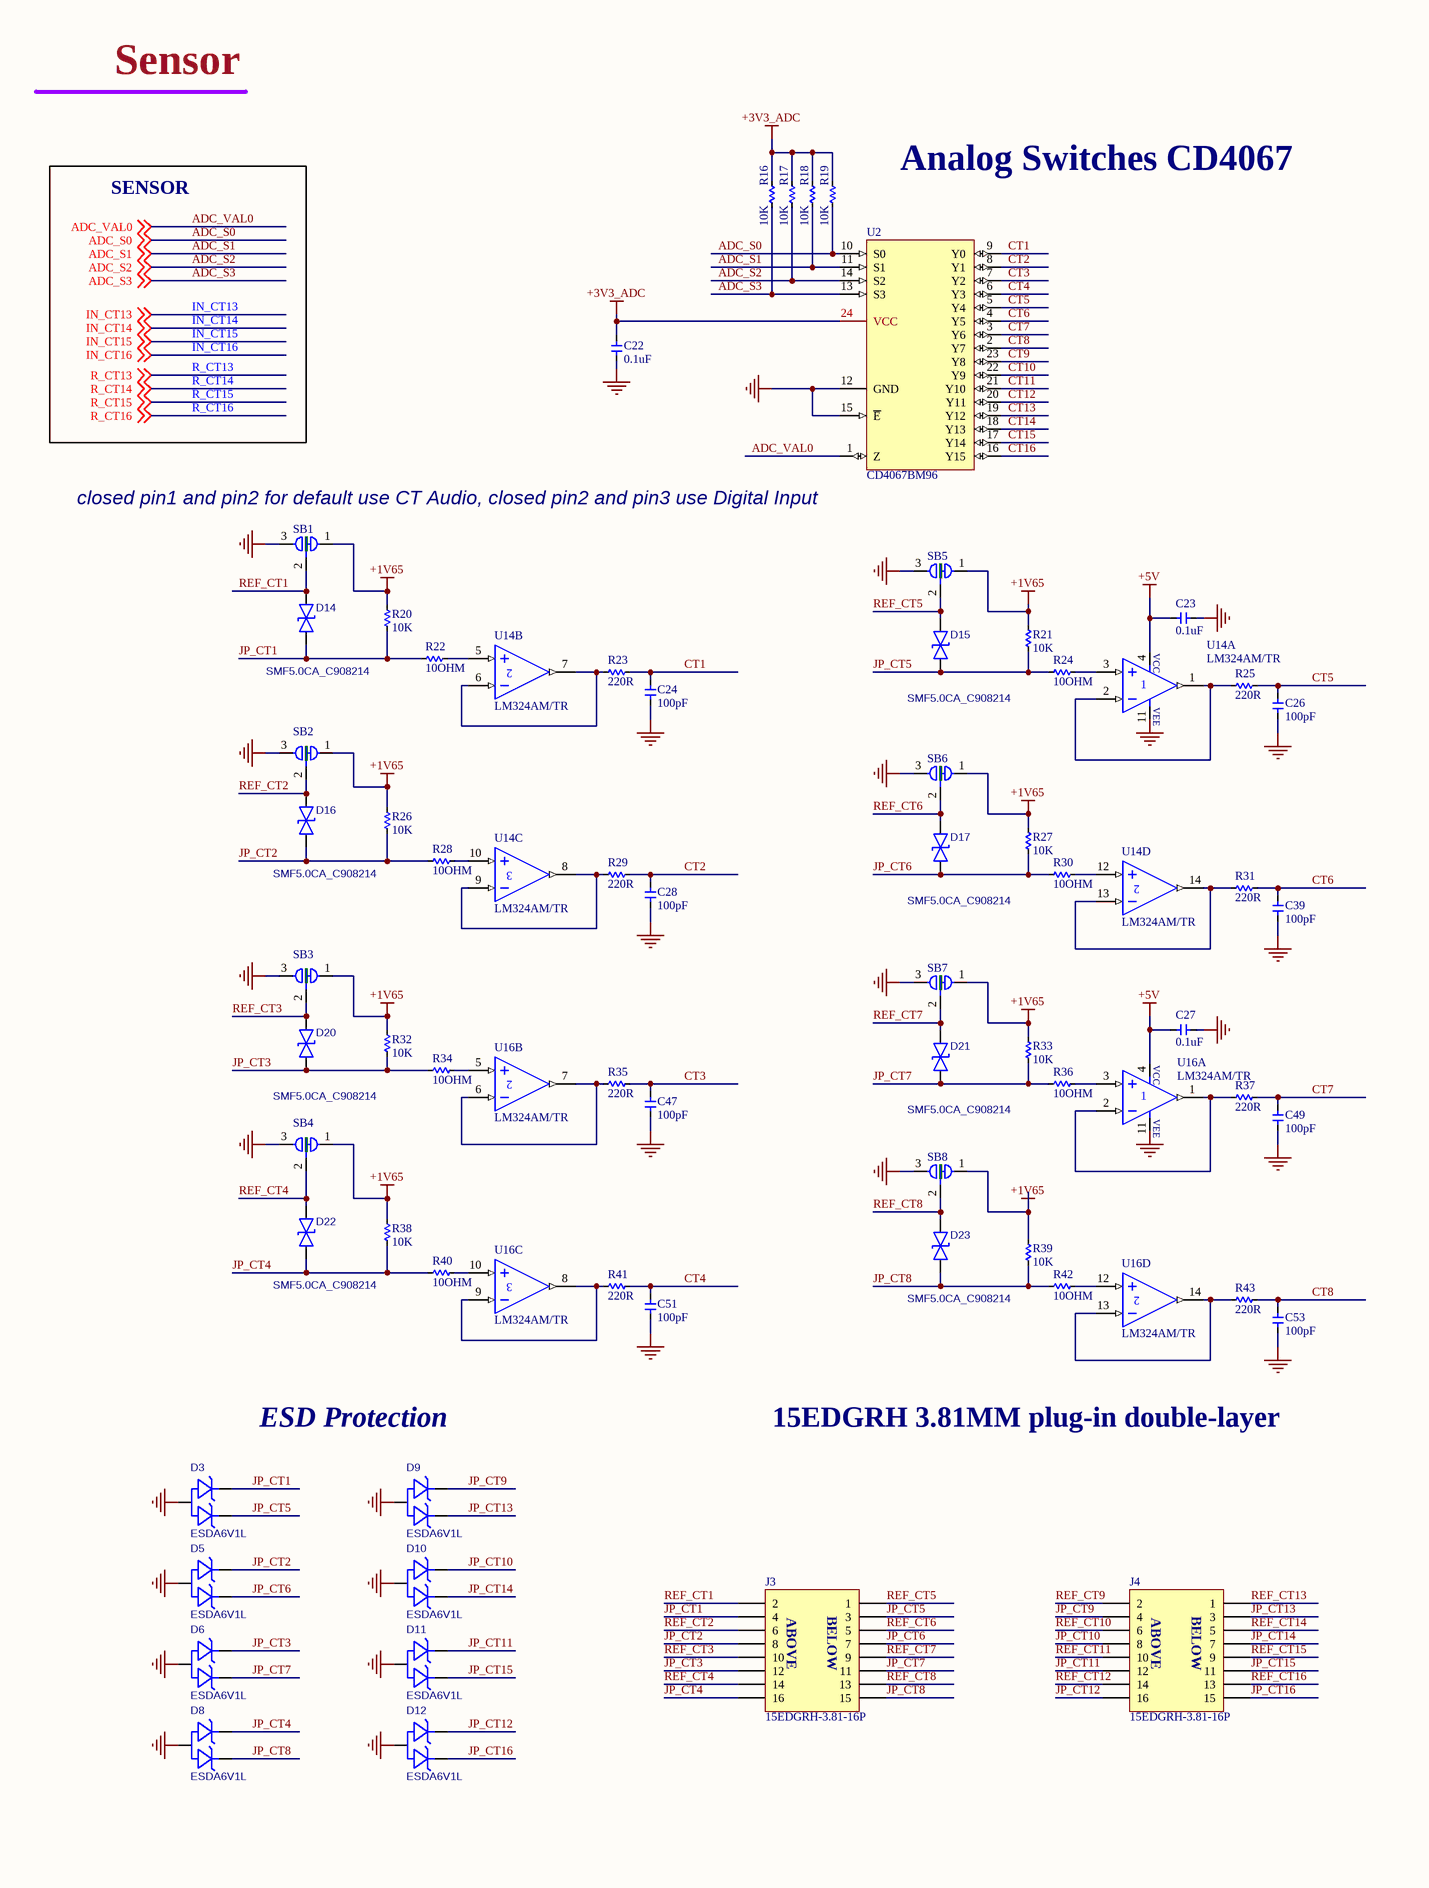
[diagram p3: Sensor.SchDoc, left]
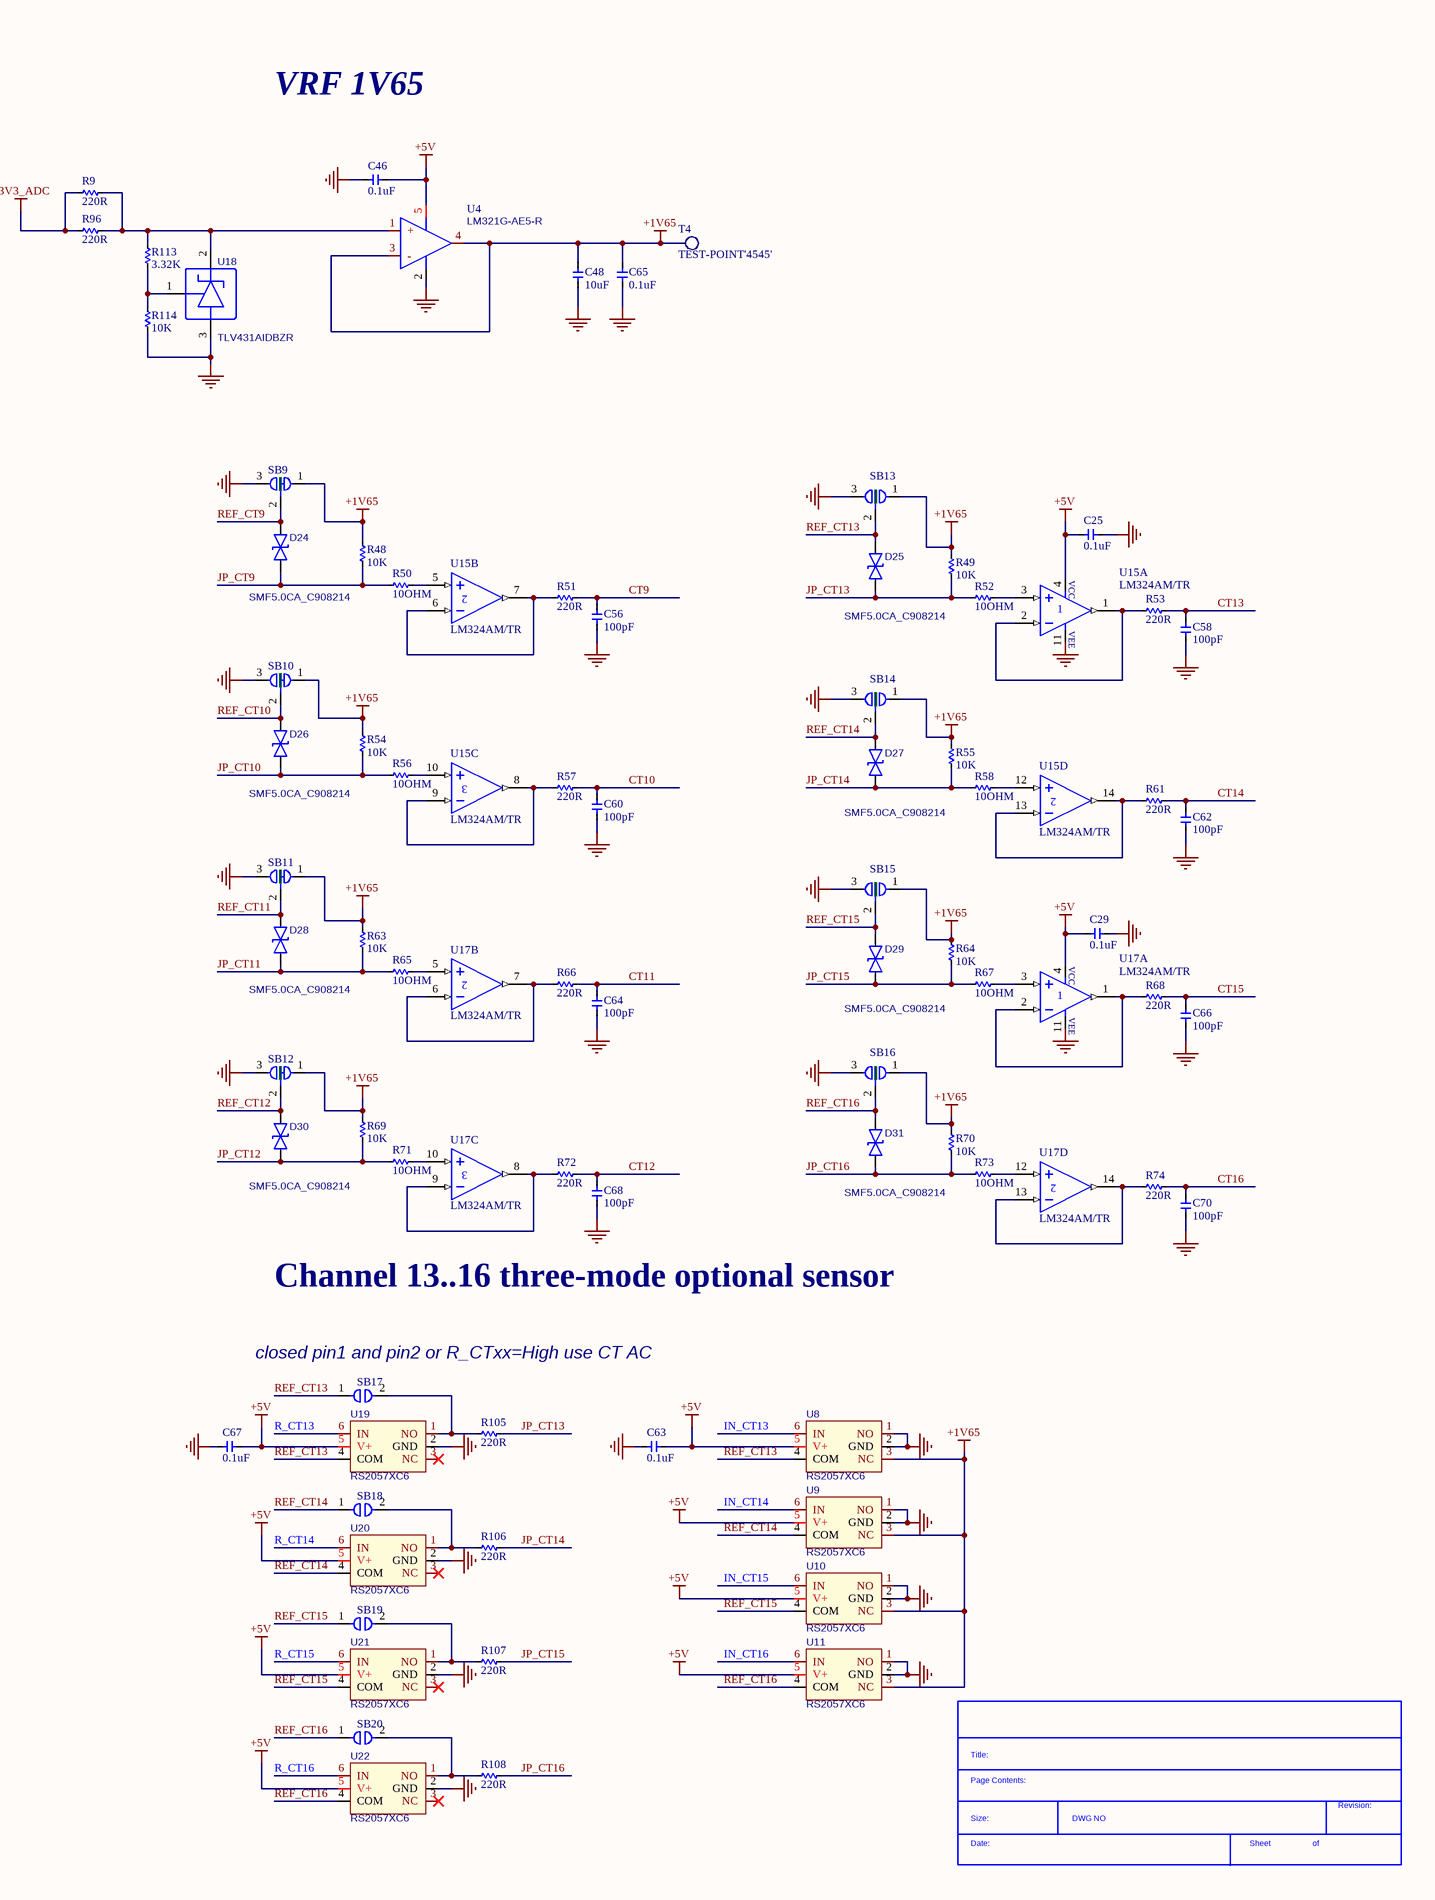
[diagram p4: Sensor.SchDoc, right]

### Parts
(Parts that share a designator on the sheet are numbered #1, #2 ... from top to bottom, then left to right.)
*?#4  SDTitleBlock  (value not drawn)  (graphical)
C22  0.1uF  [C_0603]
C23  0.1uF  [C_0603]
C24  100pF  [C_0603]
C25  0.1uF  [C_0603]
C26  100pF  [C_0603]
C27  0.1uF  [C_0603]
C28  100pF  [C_0603]
C29  0.1uF  [C_0603]
C39  100pF  [C_0603]
C46  0.1uF  [C_0603]
C47  100pF  [C_0603]
C48  10uF  [C_0603]
C49  100pF  [C_0603]
C51  100pF  [C_0603]
C53  100pF  [C_0603]
C56  100pF  [C_0603]
C58  100pF  [C_0603]
C60  100pF  [C_0603]
C62  100pF  [C_0603]
C63  0.1uF  [C_0603]
C64  100pF  [C_0603]
C65  0.1uF  [C_0603]
C66  100pF  [C_0603]
C67  0.1uF  [C_0603]
C68  100pF  [C_0603]
C70  100pF  [C_0603]
D3  ESDA6V1L  [SOT-23-3_L2.9-W1.3-P1.90-LS2.4-BR]
D5  ESDA6V1L  [SOT-23-3_L2.9-W1.3-P1.90-LS2.4-BR]
D6  ESDA6V1L  [SOT-23-3_L2.9-W1.3-P1.90-LS2.4-BR]
D8  ESDA6V1L  [SOT-23-3_L2.9-W1.3-P1.90-LS2.4-BR]
D9  ESDA6V1L  [SOT-23-3_L2.9-W1.3-P1.90-LS2.4-BR]
D10  ESDA6V1L  [SOT-23-3_L2.9-W1.3-P1.90-LS2.4-BR]
D11  ESDA6V1L  [SOT-23-3_L2.9-W1.3-P1.90-LS2.4-BR]
D12  ESDA6V1L  [SOT-23-3_L2.9-W1.3-P1.90-LS2.4-BR]
D14  SMF5.0CA_C908214  [SOD-123_L2.8-W1.8-LS3.7-BI]
D15  SMF5.0CA_C908214  [SOD-123_L2.8-W1.8-LS3.7-BI]
D16  SMF5.0CA_C908214  [SOD-123_L2.8-W1.8-LS3.7-BI]
D17  SMF5.0CA_C908214  [SOD-123_L2.8-W1.8-LS3.7-BI]
D20  SMF5.0CA_C908214  [SOD-123_L2.8-W1.8-LS3.7-BI]
D21  SMF5.0CA_C908214  [SOD-123_L2.8-W1.8-LS3.7-BI]
D22  SMF5.0CA_C908214  [SOD-123_L2.8-W1.8-LS3.7-BI]
D23  SMF5.0CA_C908214  [SOD-123_L2.8-W1.8-LS3.7-BI]
D24  SMF5.0CA_C908214  [SOD-123_L2.8-W1.8-LS3.7-BI]
D25  SMF5.0CA_C908214  [SOD-123_L2.8-W1.8-LS3.7-BI]
D26  SMF5.0CA_C908214  [SOD-123_L2.8-W1.8-LS3.7-BI]
D27  SMF5.0CA_C908214  [SOD-123_L2.8-W1.8-LS3.7-BI]
D28  SMF5.0CA_C908214  [SOD-123_L2.8-W1.8-LS3.7-BI]
D29  SMF5.0CA_C908214  [SOD-123_L2.8-W1.8-LS3.7-BI]
D30  SMF5.0CA_C908214  [SOD-123_L2.8-W1.8-LS3.7-BI]
D31  SMF5.0CA_C908214  [SOD-123_L2.8-W1.8-LS3.7-BI]
J3  15EDGRH-3.81-16P  [Header 3.81 8 pin dual row]
J4  15EDGRH-3.81-16P  [Header 3.81 8 pin dual row]
R9  220R  [R_0603]
R16  10K  [R_0603]
R17  10K  [R_0603]
R18  10K  [R_0603]
R19  10K  [R_0603]
R20  10K  [R_0603]
R21  10K  [R_0603]
R22  10OHM  [R_0603]
R23  220R  [R_0603]
R24  10OHM  [R_0603]
R25  220R  [R_0603]
R26  10K  [R_0603]
R27  10K  [R_0603]
R28  10OHM  [R_0603]
R29  220R  [R_0603]
R30  10OHM  [R_0603]
R31  220R  [R_0603]
R32  10K  [R_0603]
R33  10K  [R_0603]
R34  10OHM  [R_0603]
R35  220R  [R_0603]
R36  10OHM  [R_0603]
R37  220R  [R_0603]
R38  10K  [R_0603]
R39  10K  [R_0603]
R40  10OHM  [R_0603]
R41  220R  [R_0603]
R42  10OHM  [R_0603]
R43  220R  [R_0603]
R48  10K  [R_0603]
R49  10K  [R_0603]
R50  10OHM  [R_0603]
R51  220R  [R_0603]
R52  10OHM  [R_0603]
R53  220R  [R_0603]
R54  10K  [R_0603]
R55  10K  [R_0603]
R56  10OHM  [R_0603]
R57  220R  [R_0603]
R58  10OHM  [R_0603]
R61  220R  [R_0603]
R63  10K  [R_0603]
R64  10K  [R_0603]
R65  10OHM  [R_0603]
R66  220R  [R_0603]
R67  10OHM  [R_0603]
R68  220R  [R_0603]
R69  10K  [R_0603]
R70  10K  [R_0603]
R71  10OHM  [R_0603]
R72  220R  [R_0603]
R73  10OHM  [R_0603]
R74  220R  [R_0603]
R96  220R  [R_0603]
R105  220R  [R_0603]
R106  220R  [R_0603]
R107  220R  [R_0603]
R108  220R  [R_0603]
R113  3.32K  [R_0603]
R114  10K  [R_0603]
SB1  SOLDERJUMPER_2WAY  [SOLDERJUMPER_2WAY]  (value not drawn)  (no BOM)
SB2  SOLDERJUMPER_2WAY  [SOLDERJUMPER_2WAY]  (value not drawn)  (no BOM)
SB3  SOLDERJUMPER_2WAY  [SOLDERJUMPER_2WAY]  (value not drawn)  (no BOM)
SB4  SOLDERJUMPER_2WAY  [SOLDERJUMPER_2WAY]  (value not drawn)  (no BOM)
SB5  SOLDERJUMPER_2WAY  [SOLDERJUMPER_2WAY]  (value not drawn)  (no BOM)
SB6  SOLDERJUMPER_2WAY  [SOLDERJUMPER_2WAY]  (value not drawn)  (no BOM)
SB7  SOLDERJUMPER_2WAY  [SOLDERJUMPER_2WAY]  (value not drawn)  (no BOM)
SB8  SOLDERJUMPER_2WAY  [SOLDERJUMPER_2WAY]  (value not drawn)  (no BOM)
SB9  SOLDERJUMPER_2WAY  [SOLDERJUMPER_2WAY]  (value not drawn)  (no BOM)
SB10  SOLDERJUMPER_2WAY  [SOLDERJUMPER_2WAY]  (value not drawn)  (no BOM)
SB11  SOLDERJUMPER_2WAY  [SOLDERJUMPER_2WAY]  (value not drawn)  (no BOM)
SB12  SOLDERJUMPER_2WAY  [SOLDERJUMPER_2WAY]  (value not drawn)  (no BOM)
SB13  SOLDERJUMPER_2WAY_No JP  [SOLDERJUMPER_2WAY - No JP]  (value not drawn)  (no BOM)
SB14  SOLDERJUMPER_2WAY_No JP  [SOLDERJUMPER_2WAY - No JP]  (value not drawn)  (no BOM)
SB15  SOLDERJUMPER_2WAY_No JP  [SOLDERJUMPER_2WAY - No JP]  (value not drawn)  (no BOM)
SB16  SOLDERJUMPER_2WAY_No JP  [SOLDERJUMPER_2WAY - No JP]  (value not drawn)  (no BOM)
SB17  SOLDERJUMPER_1WAY  [SOLDERJUMPER_1WAY]  (value not drawn)  (no BOM)
SB18  SOLDERJUMPER_1WAY  [SOLDERJUMPER_1WAY]  (value not drawn)  (no BOM)
SB19  SOLDERJUMPER_1WAY  [SOLDERJUMPER_1WAY]  (value not drawn)  (no BOM)
SB20  SOLDERJUMPER_1WAY  [SOLDERJUMPER_1WAY]  (value not drawn)  (no BOM)
T4  TEST-POINT'4545'  [TP-D45MIL]  (no BOM)
U2  CD4067BM96  [SOIC-24_L15.4-W7.5-P1.27-LS10.3-BL]
U4  LM321G-AE5-R  [SOT-23-5_L3.0-W1.7-P0.95-LS2.8-BR]
U8  RS2057XC6  [SC-70-6_L2.2-W1.3-P0.65-LS2.2-BL]
U9  RS2057XC6  [SC-70-6_L2.2-W1.3-P0.65-LS2.2-BL]
U10  RS2057XC6  [SC-70-6_L2.2-W1.3-P0.65-LS2.2-BL]
U11  RS2057XC6  [SC-70-6_L2.2-W1.3-P0.65-LS2.2-BL]
U14  LM324AM/TR  [SOIC-14_3.9x8.7x1.27P]  (parts A,B,C,D of 4)
U15  LM324AM/TR  [SOIC-14_3.9x8.7x1.27P]  (parts A,B,C,D of 4)
U16  LM324AM/TR  [SOIC-14_3.9x8.7x1.27P]  (parts A,B,C,D of 4)
U17  LM324AM/TR  [SOIC-14_3.9x8.7x1.27P]  (parts A,B,C,D of 4)
U18  TLV431AIDBZR  [SOT-23-3_L2.9-W1.3-P1.90-LS2.4-BR]
U19  RS2057XC6  [SC-70-6_L2.2-W1.3-P0.65-LS2.2-BL]
U20  RS2057XC6  [SC-70-6_L2.2-W1.3-P0.65-LS2.2-BL]
U21  RS2057XC6  [SC-70-6_L2.2-W1.3-P0.65-LS2.2-BL]
U22  RS2057XC6  [SC-70-6_L2.2-W1.3-P0.65-LS2.2-BL]

### Nets
+1V65: C48.2 C65.2 R20.1 R21.2 R26.2 R27.2 R32.1 R33.2 R38.2 R39.2 R48.2 R49.2 R54.2 R55.2 R63.2 R64.2 R69.2 R70.2 SB1.1 SB2.1 SB3.1 SB4.1 SB5.1 SB6.1 SB7.1 SB8.1 SB9.1 SB10.1 SB11.1 SB12.1 SB13.1 SB14.1 SB15.1 SB16.1 T4.T U4.3(-) U4.4(OUT) U8.3(NC) U9.3(NC) U10.3(NC) U11.3(NC)
+3V3_ADC: C22.2 R9.1 R16.2 R17.2 R18.2 R19.2 R96.1 U2.24(VCC)
+5V: C23.2 C25.2 C27.2 C29.2 C46.2 C63.1 C67.1 U4.5(VCC+) U8.5(V+) U9.5(V+) U10.5(V+) U11.5(V+) U14.4(V+) U15.4(V+) U16.4(V+) U17.4(V+) U19.5(V+) U20.5(V+) U21.5(V+) U22.5(V+)
GND: C22.1 C23.1 C24.1 C25.1 C26.1 C27.1 C28.1 C29.1 C39.1 C46.1 C47.1 C48.1 C49.1 C51.1 C53.1 C56.1 C58.1 C60.1 C62.1 C63.2 C64.1 C65.1 C66.1 C67.2 C68.1 C70.1 D3.3(A) D5.3(A) D6.3(A) D8.3(A) D9.3(A) D10.3(A) D11.3(A) D12.3(A) R114.2 SB1.3 SB2.3 SB3.3 SB4.3 SB5.3 SB6.3 SB7.3 SB8.3 SB9.3 SB10.3 SB11.3 SB12.3 SB13.3 SB14.3 SB15.3 SB16.3 U2.12(GND) U2.15(~{E}) U4.2(GND) U8.1(NO) U8.2(GND) U9.1(NO) U9.2(GND) U10.1(NO) U10.2(GND) U11.1(NO) U11.2(GND) U14.11(V-) U15.11(V-) U16.11(V-) U17.11(V-) U18.3(A) U19.2(GND) U20.2(GND) U21.2(GND) U22.2(GND)
ADC_S0: R19.1 U2.10(S0) ; off-sheet ADC_S0
ADC_S1: R18.1 U2.11(S1) ; off-sheet ADC_S1
ADC_S2: R17.1 U2.14(S2) ; off-sheet ADC_S2
ADC_S3: R16.1 U2.13(S3) ; off-sheet ADC_S3
ADC_VAL0: U2.1(Z) ; off-sheet ADC_VAL0
CT1: C24.2 R23.2 U2.9(Y0)
CT2: C28.2 R29.2 U2.8(Y1)
CT3: C47.2 R35.2 U2.7(Y2)
CT4: C51.2 R41.2 U2.6(Y3)
CT5: C26.2 R25.2 U2.5(Y4)
CT6: C39.2 R31.2 U2.4(Y5)
CT7: C49.2 R37.2 U2.3(Y6)
CT8: C53.2 R43.2 U2.2(Y7)
CT9: C56.2 R51.2 U2.23(Y8)
CT10: C60.2 R57.2 U2.22(Y9)
CT11: C64.2 R66.2 U2.21(Y10)
CT12: C68.2 R72.2 U2.20(Y11)
CT13: C58.2 R53.2 U2.19(Y12)
CT14: C62.2 R61.2 U2.18(Y13)
CT15: C66.2 R68.2 U2.17(Y14)
CT16: C70.2 R74.2 U2.16(Y15)
IN_CT13: U8.6(IN) ; off-sheet IN_CT13
IN_CT14: U9.6(IN) ; off-sheet IN_CT14
IN_CT15: U10.6(IN) ; off-sheet IN_CT15
IN_CT16: U11.6(IN) ; off-sheet IN_CT16
JP_CT1: D3.2(C) D14.2 J3.4 R20.2 R22.2
JP_CT2: D5.2(C) D16.2 J3.8 R26.1 R28.2
JP_CT3: D6.2(C) D20.2 J3.12 R32.2 R34.2
JP_CT4: D8.2(C) D22.2 J3.16 R38.1 R40.2
JP_CT5: D3.1(C) D15.2 J3.3 R21.1 R24.2
JP_CT6: D5.1(C) D17.2 J3.7 R27.1 R30.2
JP_CT7: D6.1(C) D21.2 J3.11 R33.1 R36.2
JP_CT8: D8.1(C) D23.2 J3.15 R39.1 R42.2
JP_CT9: D9.2(C) D24.2 J4.4 R48.1 R50.2
JP_CT10: D10.2(C) D26.2 J4.8 R54.1 R56.2
JP_CT11: D11.2(C) D28.2 J4.12 R63.1 R65.2
JP_CT12: D12.2(C) D30.2 J4.16 R69.1 R71.2
JP_CT13: D9.1(C) D25.2 J4.3 R49.1 R52.2 R105.1
JP_CT14: D10.1(C) D27.2 J4.7 R55.1 R58.2 R106.1
JP_CT15: D11.1(C) D29.2 J4.11 R64.1 R67.2 R107.1
JP_CT16: D12.1(C) D31.2 J4.15 R70.1 R73.2 R108.1
R_CT13: U19.6(IN) ; off-sheet R_CT13
R_CT14: U20.6(IN) ; off-sheet R_CT14
R_CT15: U21.6(IN) ; off-sheet R_CT15
R_CT16: U22.6(IN) ; off-sheet R_CT16
REF_CT1: D14.1 J3.2 SB1.2
REF_CT2: D16.1 J3.6 SB2.2
REF_CT3: D20.1 J3.10 SB3.2
REF_CT4: D22.1 J3.14 SB4.2
REF_CT5: D15.1 J3.1 SB5.2
REF_CT6: D17.1 J3.5 SB6.2
REF_CT7: D21.1 J3.9 SB7.2
REF_CT8: D23.1 J3.13 SB8.2
REF_CT9: D24.1 J4.2 SB9.2
REF_CT10: D26.1 J4.6 SB10.2
REF_CT11: D28.1 J4.10 SB11.2
REF_CT12: D30.1 J4.14 SB12.2
REF_CT13: D25.1 J4.1 SB13.2 SB17.1 U8.4(COM) U19.4(COM)
REF_CT14: D27.1 J4.5 SB14.2 SB18.1 U9.4(COM) U20.4(COM)
REF_CT15: D29.1 J4.9 SB15.2 SB19.1 U10.4(COM) U21.4(COM)
REF_CT16: D31.1 J4.13 SB16.2 SB20.1 U11.4(COM) U22.4(COM)
NetR9_2: R9.2 R96.2 R113.1 U4.1(+) U18.2(C)
NetR22_1: R22.1 U14.5(IN+)
NetR23_1: R23.1 U14.6(IN-) U14.7(OUT)
NetR24_1: R24.1 U14.3(IN+)
NetR25_1: R25.1 U14.1(OUT) U14.2(IN-)
NetR28_1: R28.1 U14.10(IN+)
NetR29_1: R29.1 U14.8(OUT) U14.9(IN-)
NetR30_1: R30.1 U14.12(IN+)
NetR31_1: R31.1 U14.13(IN-) U14.14(OUT)
NetR34_1: R34.1 U16.5(IN+)
NetR35_1: R35.1 U16.6(IN-) U16.7(OUT)
NetR36_1: R36.1 U16.3(IN+)
NetR37_1: R37.1 U16.1(OUT) U16.2(IN-)
NetR40_1: R40.1 U16.10(IN+)
NetR41_1: R41.1 U16.8(OUT) U16.9(IN-)
NetR42_1: R42.1 U16.12(IN+)
NetR43_1: R43.1 U16.13(IN-) U16.14(OUT)
NetR50_1: R50.1 U15.5(IN+)
NetR51_1: R51.1 U15.6(IN-) U15.7(OUT)
NetR52_1: R52.1 U15.3(IN+)
NetR53_1: R53.1 U15.1(OUT) U15.2(IN-)
NetR56_1: R56.1 U15.10(IN+)
NetR57_1: R57.1 U15.8(OUT) U15.9(IN-)
NetR58_1: R58.1 U15.12(IN+)
NetR61_1: R61.1 U15.13(IN-) U15.14(OUT)
NetR65_1: R65.1 U17.5(IN+)
NetR66_1: R66.1 U17.6(IN-) U17.7(OUT)
NetR67_1: R67.1 U17.3(IN+)
NetR68_1: R68.1 U17.1(OUT) U17.2(IN-)
NetR71_1: R71.1 U17.10(IN+)
NetR72_1: R72.1 U17.8(OUT) U17.9(IN-)
NetR73_1: R73.1 U17.12(IN+)
NetR74_1: R74.1 U17.13(IN-) U17.14(OUT)
NetR105_2: R105.2 SB17.2 U19.1(NO)
NetR106_2: R106.2 SB18.2 U20.1(NO)
NetR107_2: R107.2 SB19.2 U21.1(NO)
NetR108_2: R108.2 SB20.2 U22.1(NO)
NetR113_2: R113.2 R114.1 U18.1(REF)

Not connected (* = marked no-connect by the designer): U19 3(NC)*; U20 3(NC)*; U21 3(NC)*; U22 3(NC)*

### Notes on the sheet
- Sensor
- SENSOR
- Analog Switches CD4067
- VRF 1V65
- closed pin1 and pin2 for default use CT Audio, closed pin2 and pin3 use Digital Input
- ESD Protection
- 15EDGRH 3.81MM plug-in double-layer
- Channel 13..16 three-mode optional sensor
- (near SB17) closed pin1 and pin2 or R_CTxx=High use CT AC
- (in symbol 15EDGRH-3.81-2x8P) ABOVE; BELOW
- (in symbol LM324AM/TR, part A) VCC; VEE
- (in symbol SDTitleBlock) Title:; Page Contents:; Revision:; Size:; DWG NO; Date:; Sheet; of

### Library data of the parts
*?#4 = SDTitleBlock: TitleBlock
C22 C23 C25 C27 C29 C46 C63 C65 C67 = CC0603KRX7R9BB104: 100NF 50V 0603 ROHS; Manufacturer: YAGEO; Manufacturer Part Number: CC0603KRX7R9BB104; Package: 0603; LCSC Part Number: C14663; ComponentLink1Description: Digikey Link; ComponentLink1URL: https://www.digikey.com/en/products/detail/yageo/CC0603KRX7R9BB104/2103082?s=N4IgTCBcDaIMwEYEFoFwCzuWZA5AIiALoC%2BQA; ComponentLink2Description: LCSC Link; ComponentLink2URL: https://jlcpcb.com/parts/componentSearch?searchTxt=10k%200603; Assembly type: SMT Assembly
C24 C26 C28 C39 C47 C49 C51 C53 C56 C58 C60 C62 C64 C66 C68 C70 = 0603CG101J500NT: as C59 on sheet Power; Manufacturer Part Number: 0603CG101J500NT; Package: 0603; LCSC Part Number: C1635; ComponentLink1Description: Digikey Link; ComponentLink2Description: LCSC Link; Assembly Type: SMT Assembly
C48 = CL10A106KP8NNNC: as C5 on sheet Power; Manufacturer Part Number: CL10A106KP8NNNC; Package: 0603; LCSC Part Number: C19702; ComponentLink1Description: Digikey Link; ComponentLink1URL: https://www.digikey.com/en/products/detail/samsung-electro-mechanics/CL10A105KB8NNNC/3887518?s=N4IgTCBcDaIMIBkCMAGAgqgrAaQEIA4A5YuEAXQF8g; ComponentLink2Description: LCSC Link; ComponentLink2URL: https://jlcpcb.com/parts/componentSearch?searchTxt=10k%200603; Assembly Type: SMT Assembly
D3 D5 D6 D8-D12 = ESDA6V1L_C587141: ESDA6V1L SOT-23-3  ESD Protection Devices ROHS; Manufacturer: TECH PUBLIC(台舟); LCSC Part Number: C587141; Manufacturer Part Number: ESDA6V1L; Package: SOT-23-3; Assembly Type: SMT Assembly
D14-D17 D20-D31 = SMF5.0CA_C908214: SMF5.0CA 9.2V 6.4V 5V SOD-123  TVS ROHS; Manufacturer: FUXINSEMI(富芯森美); LCSC Part Number: C908214; Manufacturer Part Number: SMF5.0CA; Package: SOD-123; Assembly Type: SMT Assembly
J3 J4 = 15EDGRH-3.81-2x8P: 16 Position Terminal Block Header, Male Pins, Shrouded (16 Side) 0.150" (3.81mm) 90°, Right Angle  Through Hole; Manufacturer: Phoenix Contact; Manufacturer Part Number: 1843130; Package: Through Hole; ComponentLink1URL: https://datasheet.ciiva.com/15197/getdatasheetpartid-704204-15197555.pdf?src-supplier=Verical; ComponentLink1Description: https://datasheet.ciiva.com/15197/getdatasheetpartid-704204-15197555.pdf?src-supplier=Verical; ComponentLink2URL: https://datasheet.ciiva.com/6762/1843088-6762520.pdf?src-supplier=Digi-Key; ComponentLink2Description: https://datasheet.ciiva.com/6762/1843088-6762520.pdf?src-supplier=Digi-Key; ComponentLink3URL: https://datasheet.ciiva.com/16097/1843088-16097099.pdf?src-supplier=Onlinecomponents.com; ComponentLink3Description: https://datasheet.ciiva.com/16097/1843088-16097099.pdf?src-supplier=Onlinecomponents.com; ComponentLink4URL: https://datasheet.ciiva.com/26339/772185-da-01-de-grundgehaeuse-1843088-50-st-26339092.pdf?src-supplier=Conrad; ComponentLink4Description: https://datasheet.ciiva.com/26339/772185-da-01-de-grundgehaeuse-1843088-50-st-26339092.pdf?src-supplier=Conrad; LCSC Part Number: N/A; Assembly Type: Hand Soldering
R9 R23 R25 R29 R31 R35 R37 R41 R43 R51 R53 R57 R61 R66 R68 R72 R74 R96 R105-R108 = 0603WAF2200T5E: as R79 on sheet Ethernet; Manufacturer Part Number: 0603WAF2200T5E; LCSC Part Number: C22962; Package: 0603; Assembly Type: SMT Assembly
R16-R21 R26 R27 R32 R33 R38 R39 R48 R49 R54 R55 R63 R64 R69 R70 R114 = 0603WAF1002T5E: as R100 on sheet Ethernet; Manufacturer Part Number: 0603WAF1002T5E; LCSC Part Number: C25804; Package: 0603; Assembly Type: SMT Assembly
R22 R24 R28 R30 R34 R36 R40 R42 R50 R52 R56 R58 R65 R67 R71 R73 = 0603WAF100JT5E: as R11 on sheet RS485; Manufacturer Part Number: 0603WAF100JT5E; LCSC Part Number: C22859; Package: 0603; Assembly Type: SMT Assembly
R113 = RC0603FR-073K32L: 3.32K  ±1% 1/10W 0603 ROHS; Manufacturer: Uniroyal Elec; Manufacturer Part Number: RC0603FR-073K32L; LCSC Part Number: C137731; Package: 0603; Assembly Type: SMT Assembly
SB1-SB12 = SOLDERJUMPER_2WAY: 2-Way Solder Jumper; GateName_1: G$1; SymbolName_1: SOLDERJUMPER_2WAY; LibraryName: microbuilder; DeviceSetName: SOLDERJUMPER_2WAY
SB13-SB16 = SOLDERJUMPER_2WAY_No JP: GateName_1: G$1; SymbolName_1: SOLDERJUMPER_2WAY_No JP; LibraryName: microbuilder; DeviceSetName: SOLDERJUMPER_2WAY_No JP
SB17-SB20 = SOLDERJUMPER_1WAY: GateName_1: G$1; SymbolName_1: SOLDERJUMPER_1WAY; LibraryName: microbuilder; DeviceSetName: SOLDERJUMPER_1WAY
T4 = TEST-POINT'4545': Manufacturer: No; Manufacturer Part Number: No; LCSC Part Number: No; Package: No
U2 = CD4067BM96: CD4067BM96 1 240Ω SOP-24-300mil  Analog Switches / Multiplexers ROHS; Manufacturer: Texas Instruments; Manufacturer Part Number: CD4067BM96; Package: SOIC-24-300mil; LCSC Part Number: C6525; Assembly Type: SMT Assembly
U4 = LM321G-AE5-R: 1MHz 1 General Purpose - 0.4 V/us 3V ~ 32V SOT-23-5 General Purpose Amplifiers ROHS; Manufacturer: UTC; Manufacturer Part Number: LM321G-AE5-R; LCSC Part Number: C100068; Package: SOT-23-5; Assembly Type: SMT Assembly
U8-U11 U19-U22 = RS2057XC6: 8Ω 1 SPDT(SPDT) SC-70-6  Analog Switches / Multiplexers ROHS; Manufacturer: RUNIC(润石); LCSC Part Number: C237027; Manufacturing Part Number: RS2057XC6; Package: SC-70-6; Assembly Type: C237027
U14-U17 = LM324AM/TR: LM324AM/NOPB GENERAL PURPOSE AMPLIFIERS SOIC-14 ROHS; Manufacturer: HGSEMI; Manufacturer Part Number: LM324AM/TR; Package: SOIC-14_3.9x8.7x1.27P; LCSC Part Number: C2688471; Assembly Type: SMT Assembly
U18 = TLV431AIDBZR: TLV431AIDBZR 1.24V~6V ±1% 15mA Adjustable SOT-23  Voltage References ROHS; Manufacturer: Texas Instruments; Manufacturer Part Number: TLV431AIDBZR; LCSC Part Number: C56765; Packge: SOT-23; Assembly Type: SMT Assembly

## Sheet Console.SchDoc: NH Speaker Sensor 16CH 2.3_C
size A3; Revision: 2.3; SheetNumber: 5; SheetTotal: 6
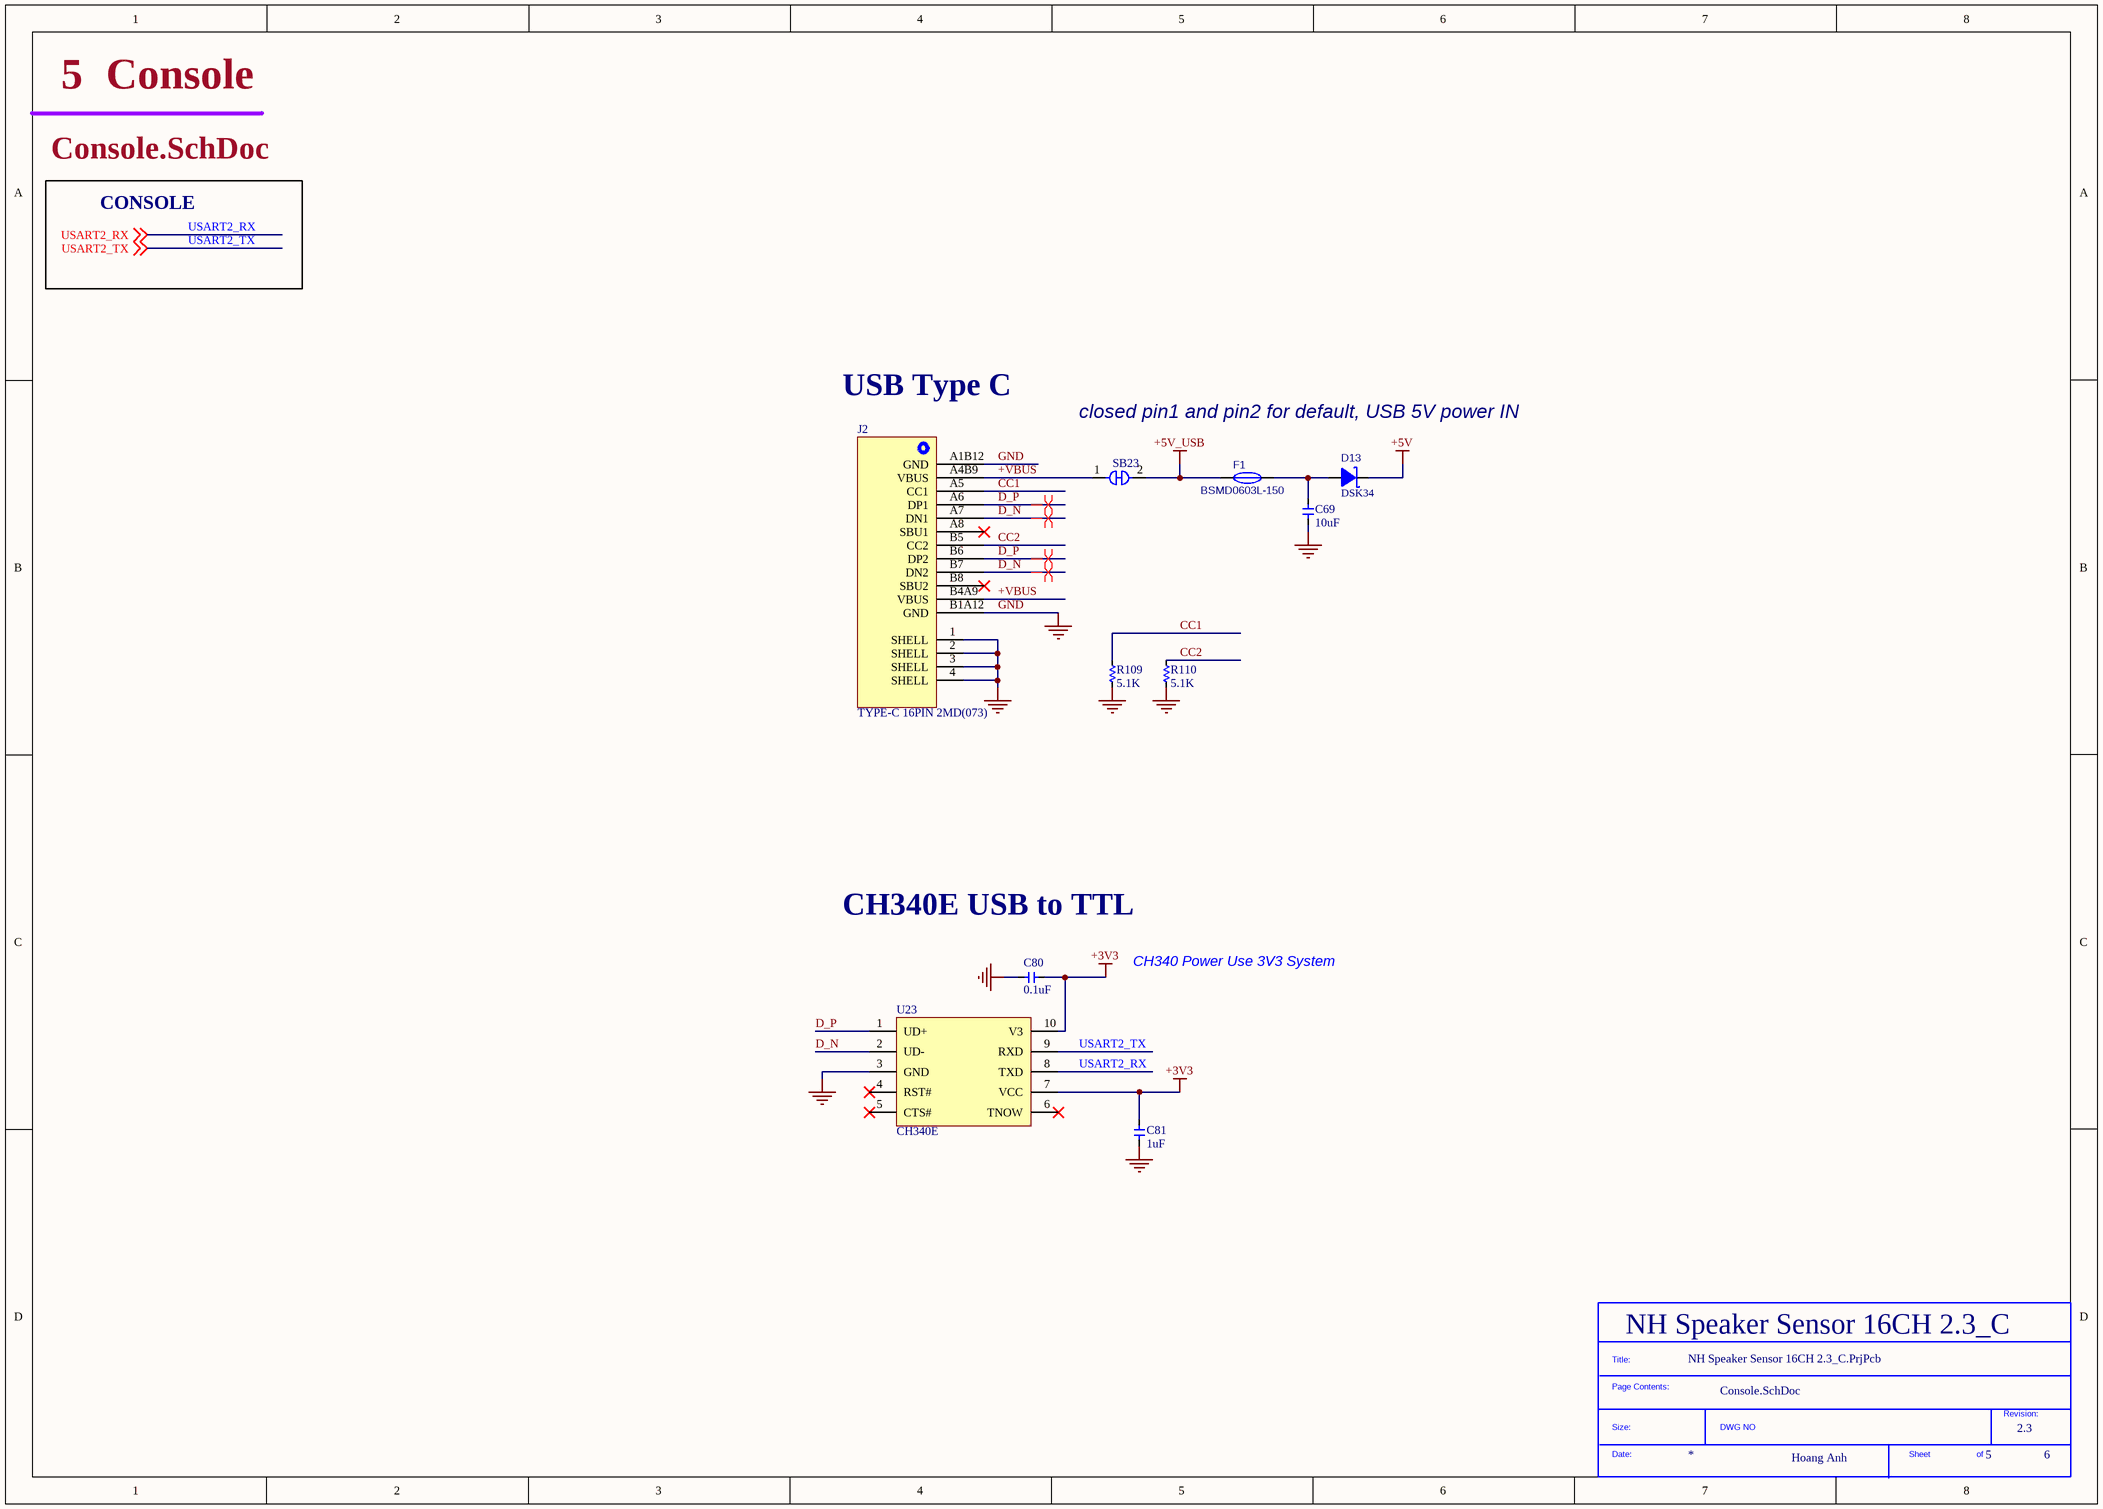
[diagram p5: Console.SchDoc]

### Parts
(Parts that share a designator on the sheet are numbered #1, #2 ... from top to bottom, then left to right.)
*?#5  SDTitleBlock  (value not drawn)  (graphical)
C69  10uF  [C_0603]
C80  0.1uF  [C_0603]
C81  1uF  [C_0603]
D13  DSK34  [SOD-123_L2.8-W1.8-LS3.7-RD]
F1  BSMD0603L-150  [F0603]
J2  TYPE-C 16PIN 2MD(073)  [USB-C-SMD_TYPE-C16PIN]
R109  5.1K  [R_0603]
R110  5.1K  [R_0603]
SB23  SOLDERJUMPER_1WAY_ON  [SOLDERJUMPER_1WAY_ON]  (value not drawn)  (no BOM)
U23  CH340E  [MSOP-10_L3.0-W3.0-P0.50-LS5.0-BL]

### Nets
+3V3: C80.1 C81.2 U23.7(VCC) U23.10(V3)
+5V: D13.1(A)
+5V_USB: F1.1 SB23.2
GND: C69.1 C80.2 C81.1 J2.1(SHELL) J2.2(SHELL) J2.3(SHELL) J2.4(SHELL) J2.A1B12(GND) J2.B1A12(GND) R109.2 R110.2 U23.3(GND)
+VBUS: J2.A4B9(VBUS) J2.B4A9(VBUS) SB23.1
CC1: J2.A5(CC1) R109.1
CC2: J2.B5(CC2) R110.1
D_N: J2.A7(DN1) J2.B7(DN2) U23.2(UD-)
D_P: J2.A6(DP1) J2.B6(DP2) U23.1(UD+)
USART2_RX: U23.8(TXD) ; off-sheet USART2_RX
USART2_TX: U23.9(RXD) ; off-sheet USART2_TX
NetC69_2: C69.2 D13.2(K) F1.2

Not connected (* = marked no-connect by the designer): J2 A8(SBU1)* B8(SBU2)*; U23 4(RST#)* 5(CTS#)* 6(TNOW)*

### Layout directives
differential pair: D_N, D_P

### Notes on the sheet
- Console
- CONSOLE
- USB Type C
- closed pin1 and pin2 for default, USB 5V power IN
- CH340E USB to TTL
- CH340 Power Use 3V3 System
- (in symbol SDTitleBlock) Title:; Page Contents:; Revision:; Size:; DWG NO; Date:; Sheet; of

### Library data of the parts
*?#5 = SDTitleBlock: TitleBlock
C69 = CL10A106KP8NNNC: as C5 on sheet Power; Manufacturer Part Number: CL10A106KP8NNNC; Package: 0603; LCSC Part Number: C19702; ComponentLink1Description: Digikey Link; ComponentLink1URL: https://www.digikey.com/en/products/detail/samsung-electro-mechanics/CL10A105KB8NNNC/3887518?s=N4IgTCBcDaIMIBkCMAGAgqgrAaQEIA4A5YuEAXQF8g; ComponentLink2Description: LCSC Link; ComponentLink2URL: https://jlcpcb.com/parts/componentSearch?searchTxt=10k%200603; Assembly Type: SMT Assembly
C80 = CC0603KRX7R9BB104: 100NF 50V 0603 ROHS; Manufacturer: YAGEO; Manufacturer Part Number: CC0603KRX7R9BB104; Package: 0603; LCSC Part Number: C14663; ComponentLink1Description: Digikey Link; ComponentLink1URL: https://www.digikey.com/en/products/detail/yageo/CC0603KRX7R9BB104/2103082?s=N4IgTCBcDaIMwEYEFoFwCzuWZA5AIiALoC%2BQA; ComponentLink2Description: LCSC Link; ComponentLink2URL: https://jlcpcb.com/parts/componentSearch?searchTxt=10k%200603; Assembly type: SMT Assembly
C81 = CL10A105KB8NNNC: as C52 on sheet Ethernet; Manufacturer Part Number: CL10A105KB8NNNC; Package: 0603; LCSC Part Number: C15849; ComponentLink1Description: Digikey Link; ComponentLink1URL: https://www.digikey.com/en/products/detail/samsung-electro-mechanics/CL10A105KB8NNNC/3887518?s=N4IgTCBcDaIMIBkCMAGAgqgrAaQEIA4A5YuEAXQF8g; ComponentLink2Description: LCSC Link; ComponentLink2URL: https://jlcpcb.com/parts/componentSearch?searchTxt=10k%200603; Assembly Type: SMT Assembly
D13 = DSK34: as D2 on sheet Power; Package: SOD-123; Manufacturer Part Number: DSK34; LCSC Part Number: C41029; Assembly Type: SMT Assembly
F1 = BSMD0603L-150: 6V 1.5A 50A 1W -40℃~+85℃ 3A 5mΩ 500ms 55mΩ 0603; Manufacturer: BHFUSE; LCSC Part Number: C914094; Manufacturer Part Number: BSMD0603L-150; Package: 0603; Assembly Type: SMT Assembly
J2 = TYPE-C 16PIN 2MD(073): 5A 1 Surface Mount 16 Female -25℃~+85℃ Type-C SMD USB Connectors ROHS; Manufacturer: SHOU HAN; Manufacturer Part Number: TYPE-C16PIN; Package: SMD; Assembly Type: SMT Assembly; LCSC Part Number: C2765186
R109 R110 = 0603WAF5101T5E: 5.1K 5.1kΩ 0603 1/10W Thick Film Resistors 75V ±1% ±100ppm/℃ -55℃~+155℃ Chip Resistor - Surface Mount ROHS; Manufacturer: Uniroyal Elec; Manufacturer Part Number: 0603WAF5101T5E; LCSC Part Number: C23186; Package: 0603; Assembly Type: SMT Assembly
SB23 = SOLDERJUMPER_1WAY_ON: GateName_1: G$1; SymbolName_1: SOLDERJUMPER_1WAY; LibraryName: microbuilder; DeviceSetName: SOLDERJUMPER_1WAY
U23 = CH340E: Transceiver USB 2.0 2Mbps MSOP-10 USB ICs RoHS; Manufacturer: WCH(Jiangsu Qin Heng); Manufacturer Part: CH340E; LCSC Part: C99652; Package: MSOP-10; Assembly Type: SMT Assembly